# EAGLE schematic working (EAGLE 7.7.0)

## Sheet 1 of 10
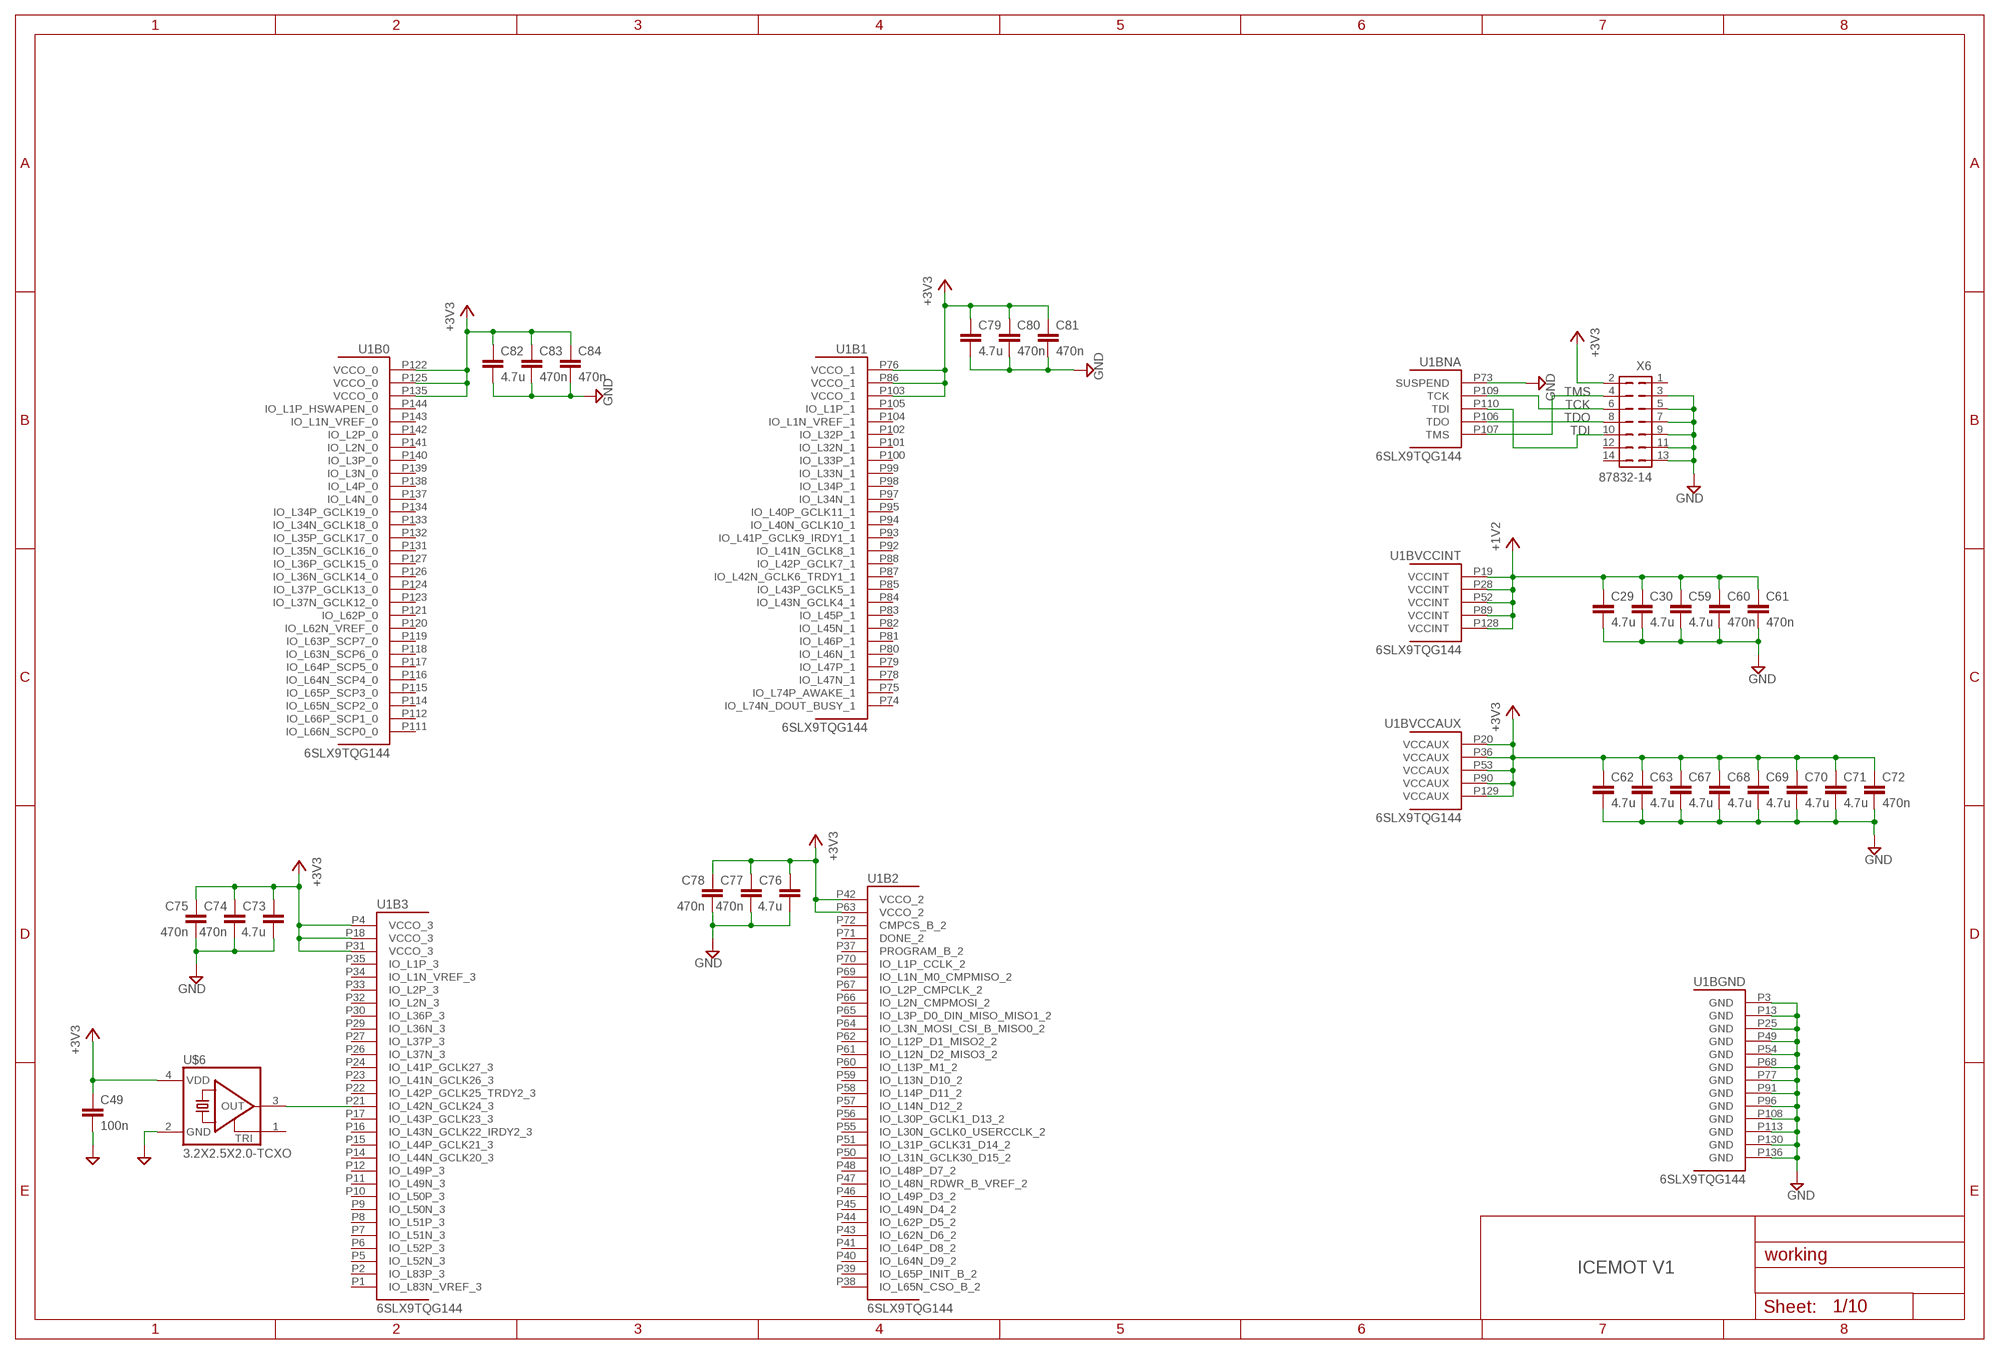
[diagram p0: schematic, sheet 1]

### Parts
C29  4.7u  C-EUC0603  [C0603]
C30  4.7u  C-EUC0603  [C0603]
C49  100n  CAP_0603  [R0603]
C59  4.7u  C-EUC0603  [C0603]
C60  470n  C-EUC0603  [C0603]
C61  470n  C-EUC0603  [C0603]
C62  4.7u  C-EUC0603  [C0603]
C63  4.7u  C-EUC0603  [C0603]
C67  4.7u  C-EUC0603  [C0603]
C68  4.7u  C-EUC0603  [C0603]
C69  4.7u  C-EUC0603  [C0603]
C70  4.7u  C-EUC0603  [C0603]
C71  4.7u  C-EUC0603  [C0603]
C72  470n  C-EUC0603  [C0603]
C73  4.7u  C-EUC0603  [C0603]
C74  470n  C-EUC0603  [C0603]
C75  470n  C-EUC0603  [C0603]
C76  4.7u  C-EUC0603  [C0603]
C77  470n  C-EUC0603  [C0603]
C78  470n  C-EUC0603  [C0603]
C79  4.7u  C-EUC0603  [C0603]
C80  470n  C-EUC0603  [C0603]
C81  470n  C-EUC0603  [C0603]
C82  4.7u  C-EUC0603  [C0603]
C83  470n  C-EUC0603  [C0603]
C84  470n  C-EUC0603  [C0603]
U1  6SLX9TQG144  [TQ144]
U$6  3.2X2.5X2.0-TCXO  [3.2X2.5X2.0-TCXO]
X6  87832-14  [87832-14]

### Nets
+1V2 [power]: C29.1 C30.1 C59.1 C60.1 C61.1
+3V3: C49.1 C62.1 C63.1 C67.1 C68.1 C69.1 C70.1 C71.1 C72.1 C73.1 C74.1 C75.1 C76.1 C77.1 C78.1 C79.1 C80.1 C81.1 C82.1 C83.1 C84.1 U1.P20(BVCCAUX:VCCAUX) U1.P36(BVCCAUX:VCCAUX) U1.P53(BVCCAUX:VCCAUX) U1.P90(BVCCAUX:VCCAUX) U1.P129(BVCCAUX:VCCAUX) U$6.4(VDD) X6.2 ; also sheet 2,3,4,5,6,7,8,9,10
GND: C29.2 C30.2 C49.2 C59.2 C60.2 C61.2 C62.2 C63.2 C67.2 C68.2 C69.2 C70.2 C71.2 C72.2 C73.2 C74.2 C75.2 C76.2 C77.2 C78.2 C79.2 C80.2 C81.2 C82.2 C83.2 C84.2 U1.P3(BGND:GND) U1.P13(BGND:GND) U1.P25(BGND:GND) U1.P49(BGND:GND) U1.P54(BGND:GND) U1.P68(BGND:GND) U1.P73(BNA:SUSPEND) U1.P77(BGND:GND) U1.P91(BGND:GND) U1.P96(BGND:GND) U1.P108(BGND:GND) U1.P113(BGND:GND) U1.P130(BGND:GND) U1.P136(BGND:GND) U$6.2(GND) X6.3 X6.5 X6.7 X6.9 X6.11 X6.13 ; also sheet 2,3,4,5,6,7,8,9,10
N$58: U1.P21(B3:IO_L42N_GCLK24_3) U$6.3(OUT)
TCK: U1.P109(BNA:TCK) X6.6
TDI: U1.P110(BNA:TDI) X6.10
TDO: U1.P106(BNA:TDO) X6.8
TMS: U1.P107(BNA:TMS) X6.4
Unconnected: U1.P1(B3:IO_L83N_VREF_3) U1.P2(B3:IO_L83P_3) U1.P4(B3:VCCO_3) U1.P5(B3:IO_L52N_3) U1.P6(B3:IO_L52P_3) U1.P7(B3:IO_L51N_3) U1.P8(B3:IO_L51P_3) U1.P9(B3:IO_L50N_3) U1.P10(B3:IO_L50P_3) U1.P11(B3:IO_L49N_3) U1.P12(B3:IO_L49P_3) U1.P14(B3:IO_L44N_GCLK20_3) U1.P15(B3:IO_L44P_GCLK21_3) U1.P16(B3:IO_L43N_GCLK22_IRDY2_3) U1.P17(B3:IO_L43P_GCLK23_3) U1.P18(B3:VCCO_3) U1.P19(BVCCINT:VCCINT) U1.P22(B3:IO_L42P_GCLK25_TRDY2_3) U1.P23(B3:IO_L41N_GCLK26_3) U1.P24(B3:IO_L41P_GCLK27_3) U1.P26(B3:IO_L37N_3) U1.P27(B3:IO_L37P_3) U1.P28(BVCCINT:VCCINT) U1.P29(B3:IO_L36N_3) U1.P30(B3:IO_L36P_3) U1.P31(B3:VCCO_3) U1.P32(B3:IO_L2N_3) U1.P33(B3:IO_L2P_3) U1.P34(B3:IO_L1N_VREF_3) U1.P35(B3:IO_L1P_3) U1.P37(B2:PROGRAM_B_2) U1.P38(B2:IO_L65N_CSO_B_2) U1.P39(B2:IO_L65P_INIT_B_2) U1.P40(B2:IO_L64N_D9_2) U1.P41(B2:IO_L64P_D8_2) U1.P42(B2:VCCO_2) U1.P43(B2:IO_L62N_D6_2) U1.P44(B2:IO_L62P_D5_2) U1.P45(B2:IO_L49N_D4_2) U1.P46(B2:IO_L49P_D3_2) U1.P47(B2:IO_L48N_RDWR_B_VREF_2) U1.P48(B2:IO_L48P_D7_2) U1.P50(B2:IO_L31N_GCLK30_D15_2) U1.P51(B2:IO_L31P_GCLK31_D14_2) U1.P52(BVCCINT:VCCINT) U1.P55(B2:IO_L30N_GCLK0_USERCCLK_2) U1.P56(B2:IO_L30P_GCLK1_D13_2) U1.P57(B2:IO_L14N_D12_2) U1.P58(B2:IO_L14P_D11_2) U1.P59(B2:IO_L13N_D10_2) U1.P60(B2:IO_L13P_M1_2) U1.P61(B2:IO_L12N_D2_MISO3_2) U1.P62(B2:IO_L12P_D1_MISO2_2) U1.P63(B2:VCCO_2) U1.P64(B2:IO_L3N_MOSI_CSI_B_MISO0_2) U1.P65(B2:IO_L3P_D0_DIN_MISO_MISO1_2) U1.P66(B2:IO_L2N_CMPMOSI_2) U1.P67(B2:IO_L2P_CMPCLK_2) U1.P69(B2:IO_L1N_M0_CMPMISO_2) U1.P70(B2:IO_L1P_CCLK_2) U1.P71(B2:DONE_2) U1.P72(B2:CMPCS_B_2) U1.P74(B1:IO_L74N_DOUT_BUSY_1) U1.P75(B1:IO_L74P_AWAKE_1) U1.P76(B1:VCCO_1) U1.P78(B1:IO_L47N_1) U1.P79(B1:IO_L47P_1) U1.P80(B1:IO_L46N_1) U1.P81(B1:IO_L46P_1) U1.P82(B1:IO_L45N_1) U1.P83(B1:IO_L45P_1) U1.P84(B1:IO_L43N_GCLK4_1) U1.P85(B1:IO_L43P_GCLK5_1) U1.P86(B1:VCCO_1) U1.P87(B1:IO_L42N_GCLK6_TRDY1_1) U1.P88(B1:IO_L42P_GCLK7_1) U1.P89(BVCCINT:VCCINT) U1.P92(B1:IO_L41N_GCLK8_1) U1.P93(B1:IO_L41P_GCLK9_IRDY1_1) U1.P94(B1:IO_L40N_GCLK10_1) U1.P95(B1:IO_L40P_GCLK11_1) U1.P97(B1:IO_L34N_1) U1.P98(B1:IO_L34P_1) U1.P99(B1:IO_L33N_1) U1.P100(B1:IO_L33P_1) U1.P101(B1:IO_L32N_1) U1.P102(B1:IO_L32P_1) U1.P103(B1:VCCO_1) U1.P104(B1:IO_L1N_VREF_1) U1.P105(B1:IO_L1P_1) U1.P111(B0:IO_L66N_SCP0_0) U1.P112(B0:IO_L66P_SCP1_0) U1.P114(B0:IO_L65N_SCP2_0) U1.P115(B0:IO_L65P_SCP3_0) U1.P116(B0:IO_L64N_SCP4_0) U1.P117(B0:IO_L64P_SCP5_0) U1.P118(B0:IO_L63N_SCP6_0) U1.P119(B0:IO_L63P_SCP7_0) U1.P120(B0:IO_L62N_VREF_0) U1.P121(B0:IO_L62P_0) U1.P122(B0:VCCO_0) U1.P123(B0:IO_L37N_GCLK12_0) U1.P124(B0:IO_L37P_GCLK13_0) U1.P125(B0:VCCO_0) U1.P126(B0:IO_L36N_GCLK14_0) U1.P127(B0:IO_L36P_GCLK15_0) U1.P128(BVCCINT:VCCINT) U1.P131(B0:IO_L35N_GCLK16_0) U1.P132(B0:IO_L35P_GCLK17_0) U1.P133(B0:IO_L34N_GCLK18_0) U1.P134(B0:IO_L34P_GCLK19_0) U1.P135(B0:VCCO_0) U1.P137(B0:IO_L4N_0) U1.P138(B0:IO_L4P_0) U1.P139(B0:IO_L3N_0) U1.P140(B0:IO_L3P_0) U1.P141(B0:IO_L2N_0) U1.P142(B0:IO_L2P_0) U1.P143(B0:IO_L1N_VREF_0) U1.P144(B0:IO_L1P_HSWAPEN_0) U$6.1(TRI) X6.1 X6.12 X6.14

### Notes on the sheet
- ICEMOT V1

## Sheet 2 of 10
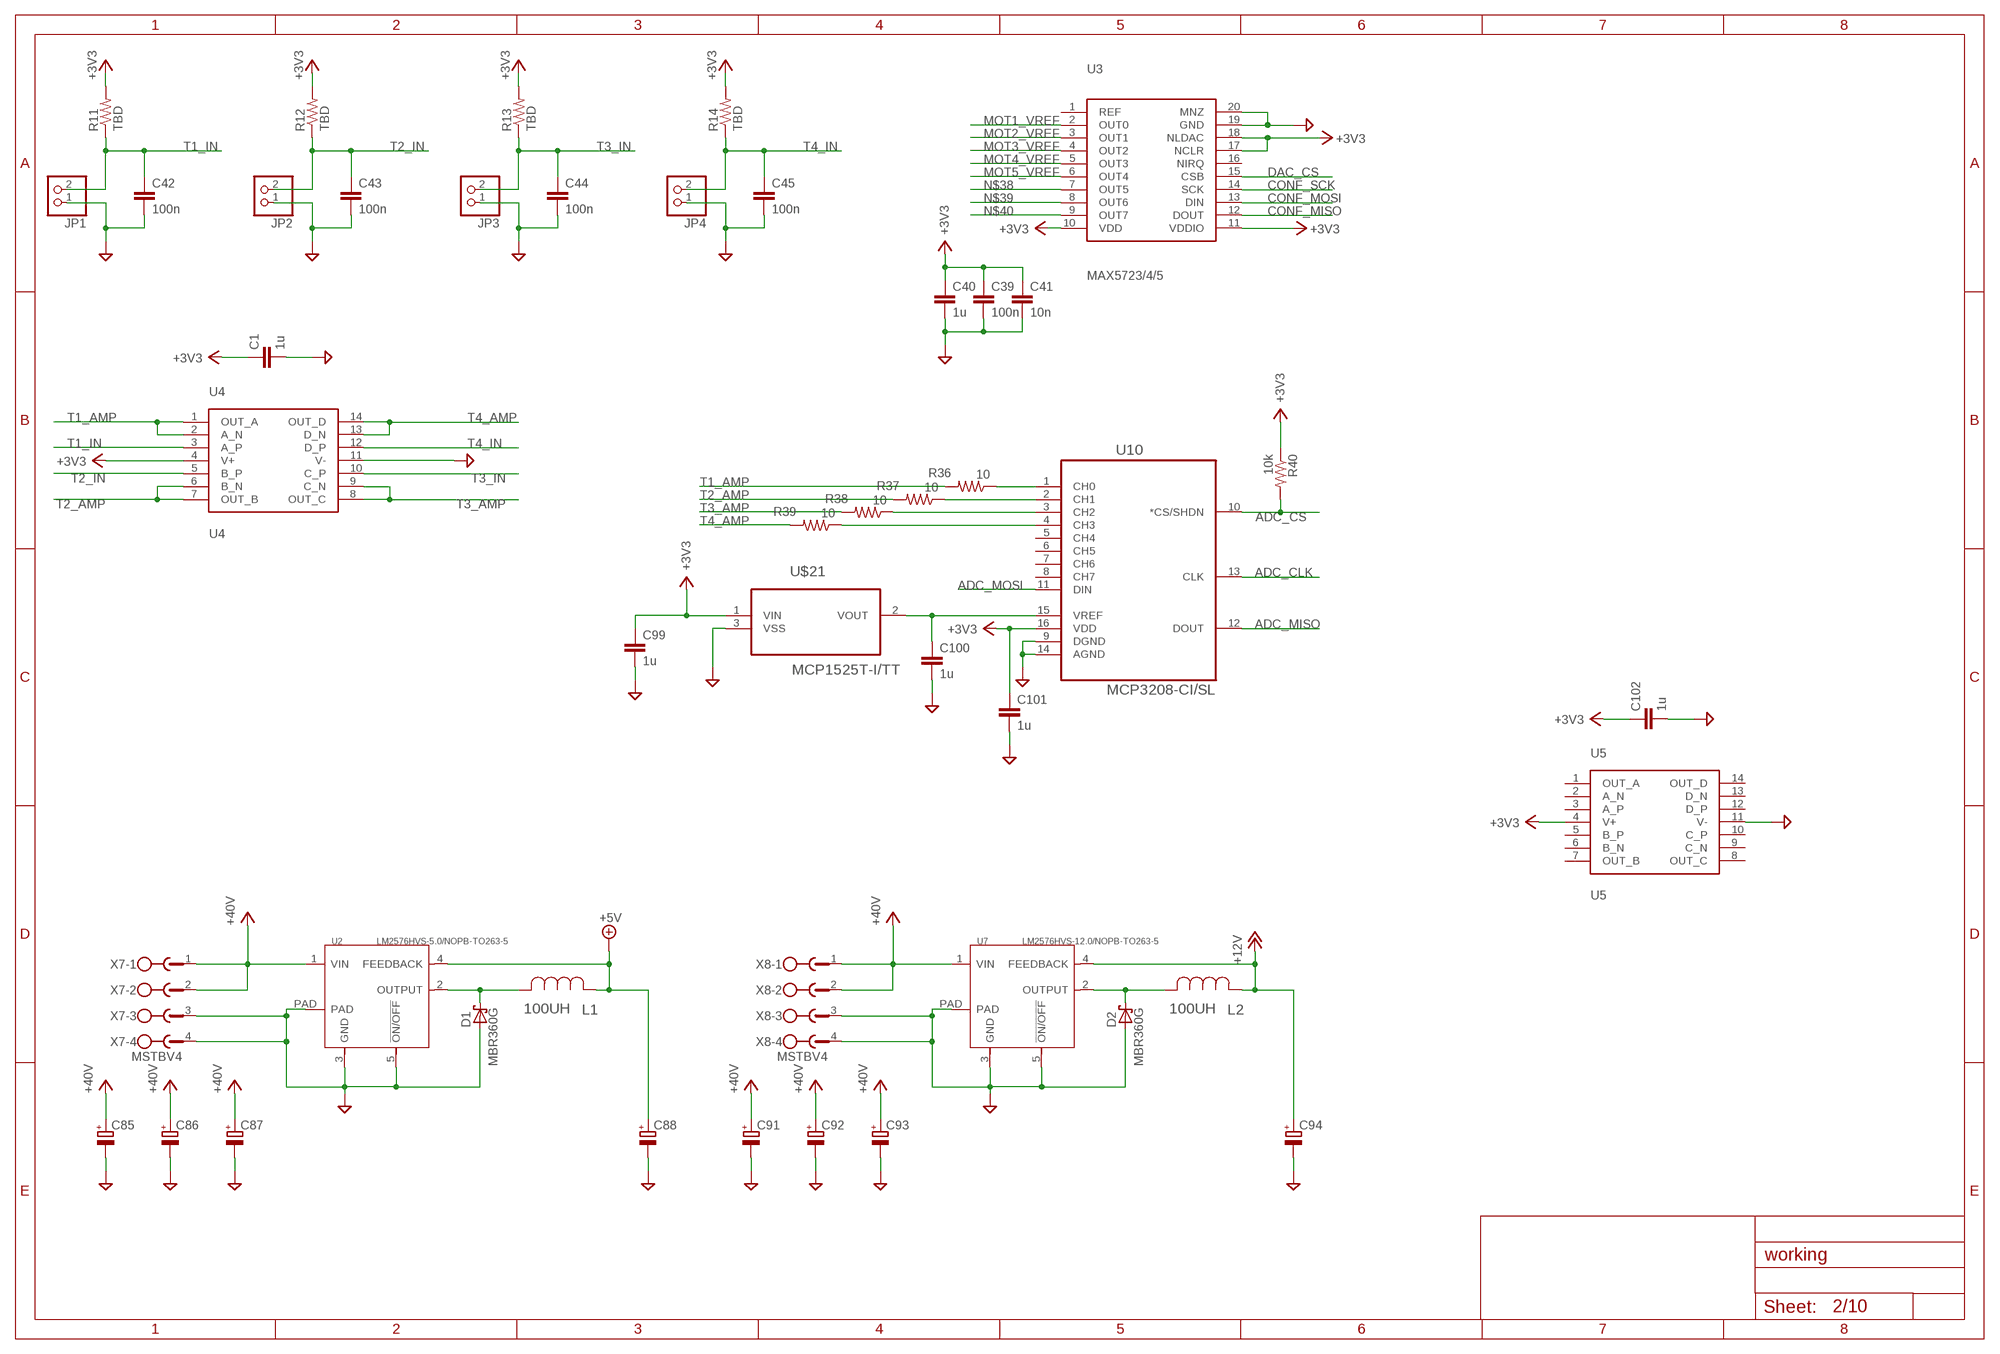
[diagram p1: schematic, sheet 2]

### Parts
C1  1u  CAP_0603  [R0603]
C39  100n  CAP_0603  [R0603]
C40  1u  CAP_0603  [R0603]
C41  10n  CAP_0603  [R0603]
C42  100n  CAP_0603  [R0603]
C43  100n  CAP_0603  [R0603]
C44  100n  CAP_0603  [R0603]
C45  100n  CAP_0603  [R0603]
C85  CPOL-EUE5-10.5  [E5-10,5]
C86  CPOL-EUE5-10.5  [E5-10,5]
C87  CPOL-EUE5-10.5  [E5-10,5]
C88  CPOL-EUE5-10.5  [E5-10,5]
C91  CPOL-EUE5-10.5  [E5-10,5]
C92  CPOL-EUE5-10.5  [E5-10,5]
C93  CPOL-EUE5-10.5  [E5-10,5]
C94  CPOL-EUE5-10.5  [E5-10,5]
C99  1u  CAP_0603  [R0603]
C100  1u  CAP_0603  [R0603]
C101  1u  CAP_0603  [R0603]
C102  1u  CAP_0603  [R0603]
D1  MBR360G  SCHOTTKY-DIODEDO201T15  [DO201T15]
D2  MBR360G  SCHOTTKY-DIODEDO201T15  [DO201T15]
JP1  PINHD-1X2  [1X02]
JP2  PINHD-1X2  [1X02]
JP3  PINHD-1X2  [1X02]
JP4  PINHD-1X2  [1X02]
L1  100UH  ELC18B101L-18B  [IND_ELC18B]
L2  100UH  ELC18B101L-18B  [IND_ELC18B]
R11  TBD  RES_0603  [R0603]
R12  TBD  RES_0603  [R0603]
R13  TBD  RES_0603  [R0603]
R14  TBD  RES_0603  [R0603]
R36  10  RES_0603  [R0603]
R37  10  RES_0603  [R0603]
R38  10  RES_0603  [R0603]
R39  10  RES_0603  [R0603]
R40  10k  RES_0603  [R0603]
U2  LM2576HVS-5.0/NOPB-TO263-5  PMIC-LM2576HVS-5.0/NOPB(TO263-5)  [TO-263-5]
U3  MAX5723/4/5  [TSSOP20-0.65-6.5X4.4MM]
U4  TLV4379  [TSSOP14-0.65-5X4.4MM]
U5  TLV4379  [TSSOP14-0.65-5X4.4MM]
U7  LM2576HVS-12.0/NOPB-TO263-5  PMIC-LM2575HVS-12.0/NOPB(TO263-5)  [TO-263-5]
U10  MCP3208-CI/SL  [SOIC127P600X175-16N]
U$21  MCP1525T-I/TT  [SOT96P237X112-3N]
X7  MSTBV4  [MSTBV4]
X8  MSTBV4  [MSTBV4]

### Nets
+3V3: C1.1 C39.1 C40.1 C41.1 C99.1 C101.1 C102.1 R11.2 R12.2 R13.2 R14.2 R40.1 U3.10(VDD) U3.11(VDDIO) U3.17(NCLR) U3.18(NLDAC) U4.4(V+) U10.16(VDD) U$21.1(VIN) ; also sheet 1,3,4,5,6,7,8,9,10
+5V: C88.+ L1.1 U2.4(FEEDBACK)
+12V: C94.+ L2.1 U7.4(FEEDBACK) ; also sheet 8,9,10
+40V: C85.+ C86.+ C87.+ C91.+ C92.+ C93.+ U2.1(VIN) U7.1(VIN) X7.1 X7.2 X8.1 X8.2 ; also sheet 3,4,5,6,7
ADC_CLK: U10.13(CLK)
ADC_CS: R40.2 U10.10(*CS/SHDN)
ADC_MISO: U10.12(DOUT)
ADC_MOSI: U10.11(DIN)
CONF_MISO: U3.12(DOUT)
CONF_MOSI: U3.13(DIN)
CONF_SCK: U3.14(SCK)
DAC_CS: U3.15(CSB)
GND: C1.2 C39.2 C40.2 C41.2 C42.2 C43.2 C44.2 C45.2 C85.- C86.- C87.- C88.- C91.- C92.- C93.- C94.- C99.2 C100.2 C101.2 C102.2 D1.A D2.A JP1.1 JP2.1 JP3.1 JP4.1 U2.3(GND) U2.5(!ON/OFF) U2.PAD U3.19(GND) U3.20(MNZ) U4.11(V-) U7.3(GND) U7.5(!ON/OFF) U7.PAD U10.9(DGND) U10.14(AGND) U$21.3(VSS) X7.3 X7.4 X8.3 X8.4 ; also sheet 1,3,4,5,6,7,8,9,10
MOT1_VREF: U3.2(OUT0) ; also sheet 3
MOT2_VREF: U3.3(OUT1) ; also sheet 4
MOT3_VREF: U3.4(OUT2) ; also sheet 5
MOT4_VREF: U3.5(OUT3) ; also sheet 6
MOT5_VREF: U3.6(OUT4) ; also sheet 7
N$37: D1.C L1.2 U2.2(OUTPUT)
N$38: U3.7(OUT5)
N$39: U3.8(OUT6)
N$40: U3.9(OUT7)
N$61: D2.C L2.2 U7.2(OUTPUT)
N$72: C100.1 U10.15(VREF) U$21.2(VOUT)
N$74: R36.1 U10.1(CH0)
N$75: R37.1 U10.2(CH1)
N$76: R38.1 U10.3(CH2)
N$77: R39.1 U10.4(CH3)
T1_AMP: R36.2 U4.1(OUT_A) U4.2(A_N)
T1_IN: C42.1 JP1.2 R11.1 U4.3(A_P)
T2_AMP: R37.2 U4.6(B_N) U4.7(OUT_B)
T2_IN: C43.1 JP2.2 R12.1 U4.5(B_P)
T3_AMP: R38.2 U4.8(OUT_C) U4.9(C_N)
T3_IN: C44.1 JP3.2 R13.1 U4.10(C_P)
T4_AMP: R39.2 U4.13(D_N) U4.14(OUT_D)
T4_IN: C45.1 JP4.2 R14.1 U4.12(D_P)
Unconnected: U3.1(REF) U3.16(NIRQ) U5.1(OUT_A) U5.2(A_N) U5.3(A_P) U5.5(B_P) U5.6(B_N) U5.7(OUT_B) U5.8(OUT_C) U5.9(C_N) U5.10(C_P) U5.12(D_P) U5.13(D_N) U5.14(OUT_D) U10.5(CH4) U10.6(CH5) U10.7(CH6) U10.8(CH7)

## Sheet 3 of 10
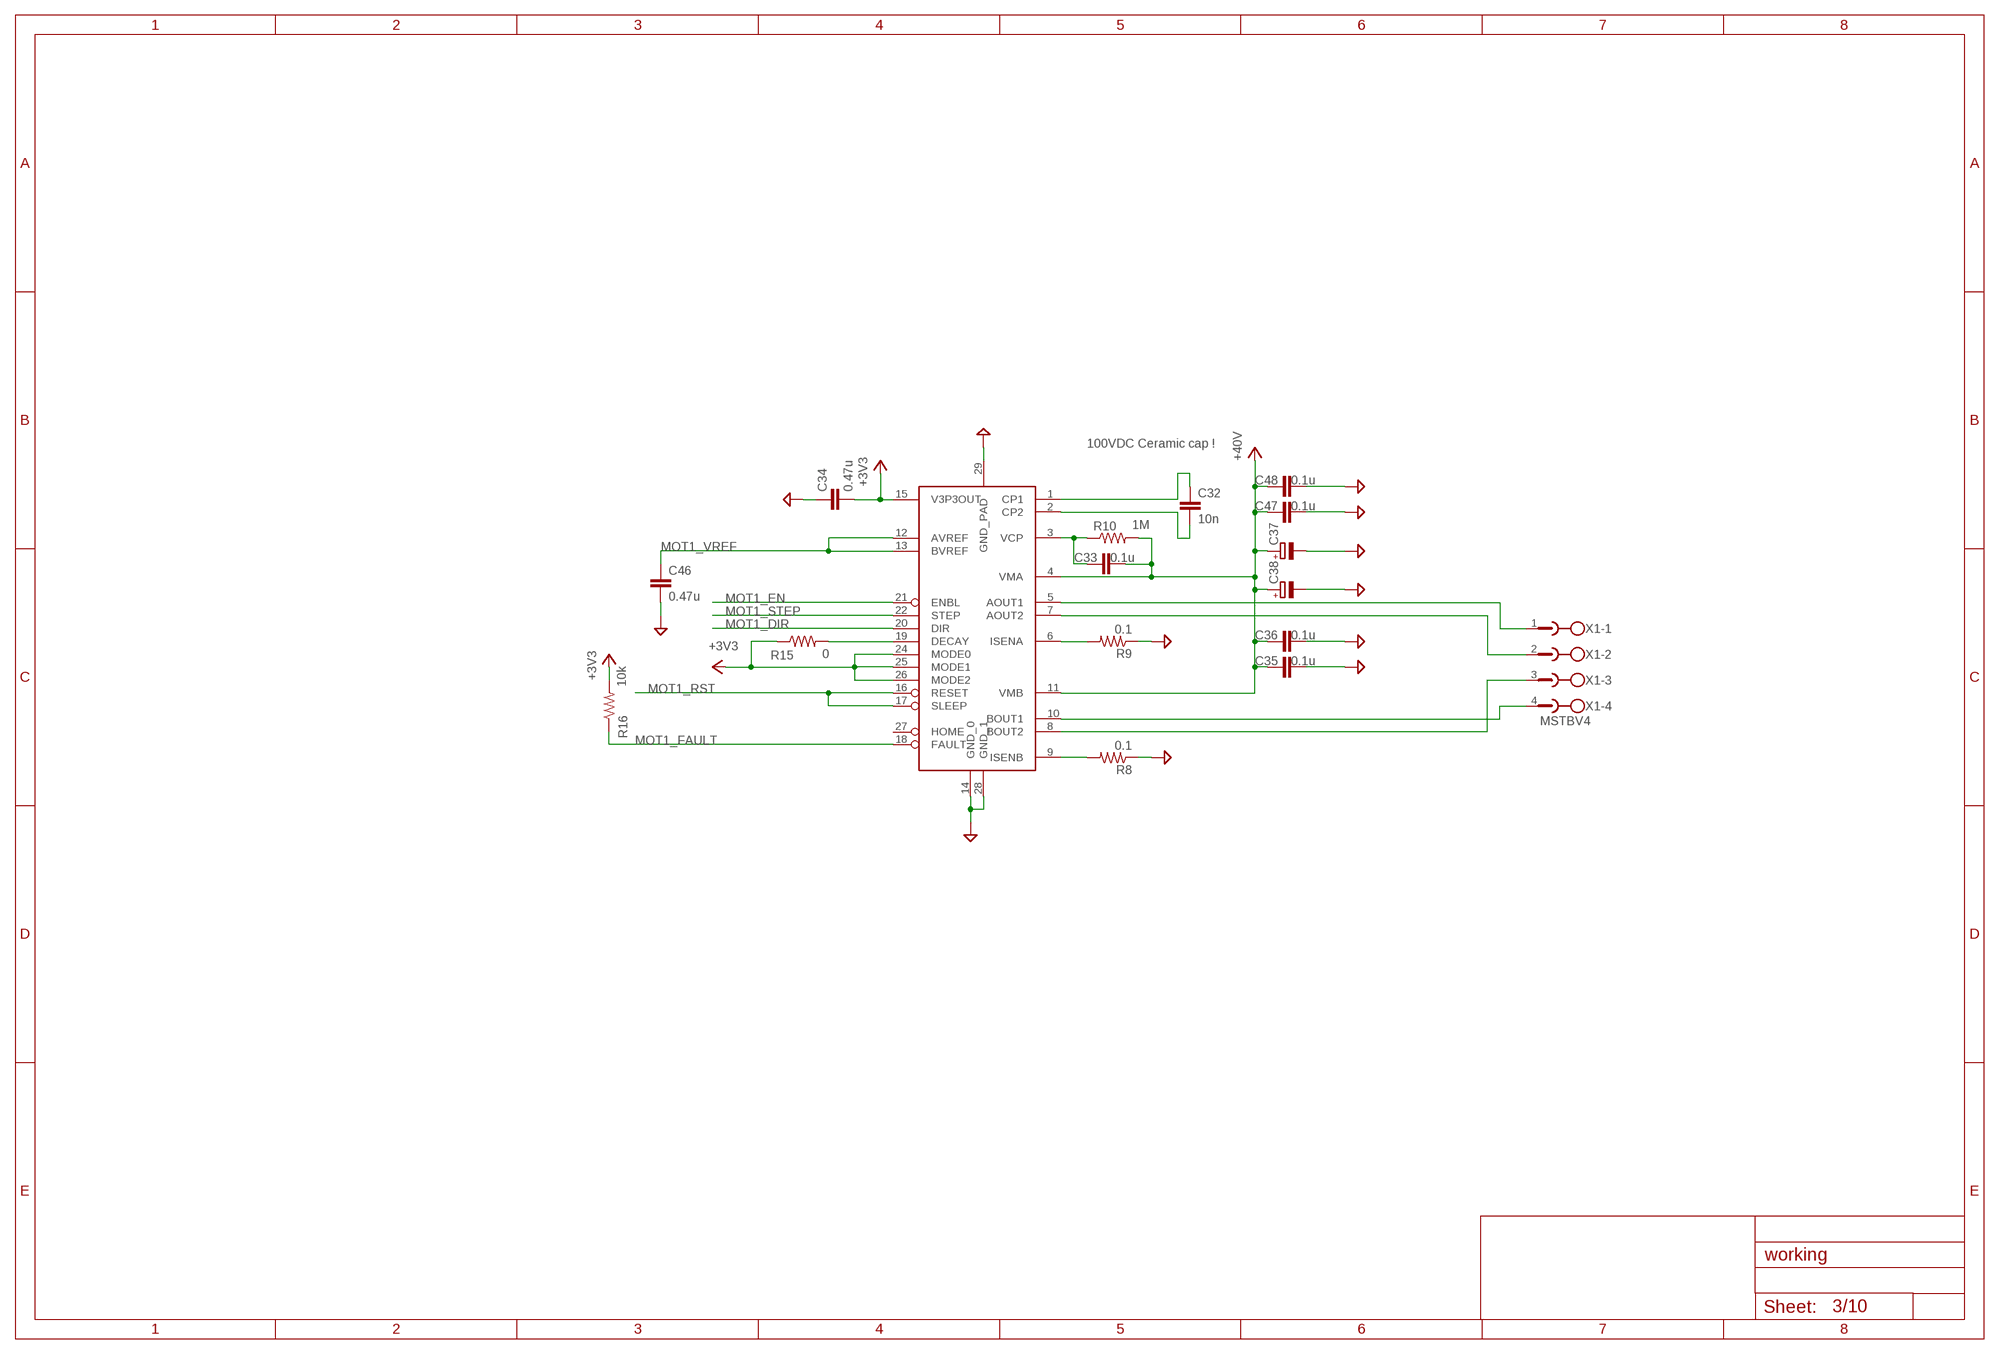
[diagram p2: schematic, sheet 3]

### Parts
C32  10n  CAP_0603  [R0603]
C33  0.1u  CAP_0603  [R0603]
C34  0.47u  CAP_0603  [R0603]
C35  0.1u  CAP_0603  [R0603]
C36  0.1u  CAP_0603  [R0603]
C37  CPOL-EUE5-5  [E5-5]
C38  CPOL-EUE5-5  [E5-5]
C46  0.47u  CAP_0603  [R0603]
C47  0.1u  CAP_0603  [R0603]
C48  0.1u  CAP_0603  [R0603]
R8  0.1  RES_1206  [R1206]
R9  0.1  RES_1206  [R1206]
R10  1M  RES_0603  [R0603]
R15  0  RES_0603  [R0603]
R16  10k  RES_0603  [R0603]
U$4  DRV8825PWP  [TSSOP-28]
X1  MSTBV4  [MSTBV4]

### Nets
+3V3: C34.2 R15.1 R16.2 U$4.15(V3P3OUT) U$4.24(MODE0) U$4.25(MODE1) U$4.26(MODE2) ; also sheet 1,2,4,5,6,7,8,9,10
+40V: C33.2 C35.1 C36.1 C37.+ C38.+ C47.1 C48.1 R10.2 U$4.4(VMA) U$4.11(VMB) ; also sheet 2,4,5,6,7
GND: C34.1 C35.2 C36.2 C37.- C38.- C46.2 C47.2 C48.2 R8.1 R9.1 U$4.14(GND_0) U$4.28(GND_1) U$4.29(GND_PAD) ; also sheet 1,2,4,5,6,7,8,9,10
MOT1_DIR: U$4.20(DIR)
MOT1_EN: U$4.21(ENBL)
MOT1_FAULT: R16.1 U$4.18(FAULT)
MOT1_RST: U$4.16(RESET) U$4.17(SLEEP)
MOT1_STEP: U$4.22(STEP)
MOT1_VREF: C46.1 U$4.12(AVREF) U$4.13(BVREF) ; also sheet 2
N$16: R9.2 U$4.6(ISENA)
N$17: R8.2 U$4.9(ISENB)
N$18: C32.1 U$4.1(CP1)
N$19: C32.2 U$4.2(CP2)
N$20: C33.1 R10.1 U$4.3(VCP)
N$24: R15.2 U$4.19(DECAY)
N$29: U$4.5(AOUT1) X1.1
N$30: U$4.7(AOUT2) X1.2
N$31: U$4.8(BOUT2) X1.3
N$32: U$4.10(BOUT1) X1.4
Unconnected: U$4.27(HOME)

### Notes on the sheet
- 100VDC Ceramic cap !

## Sheet 4 of 10
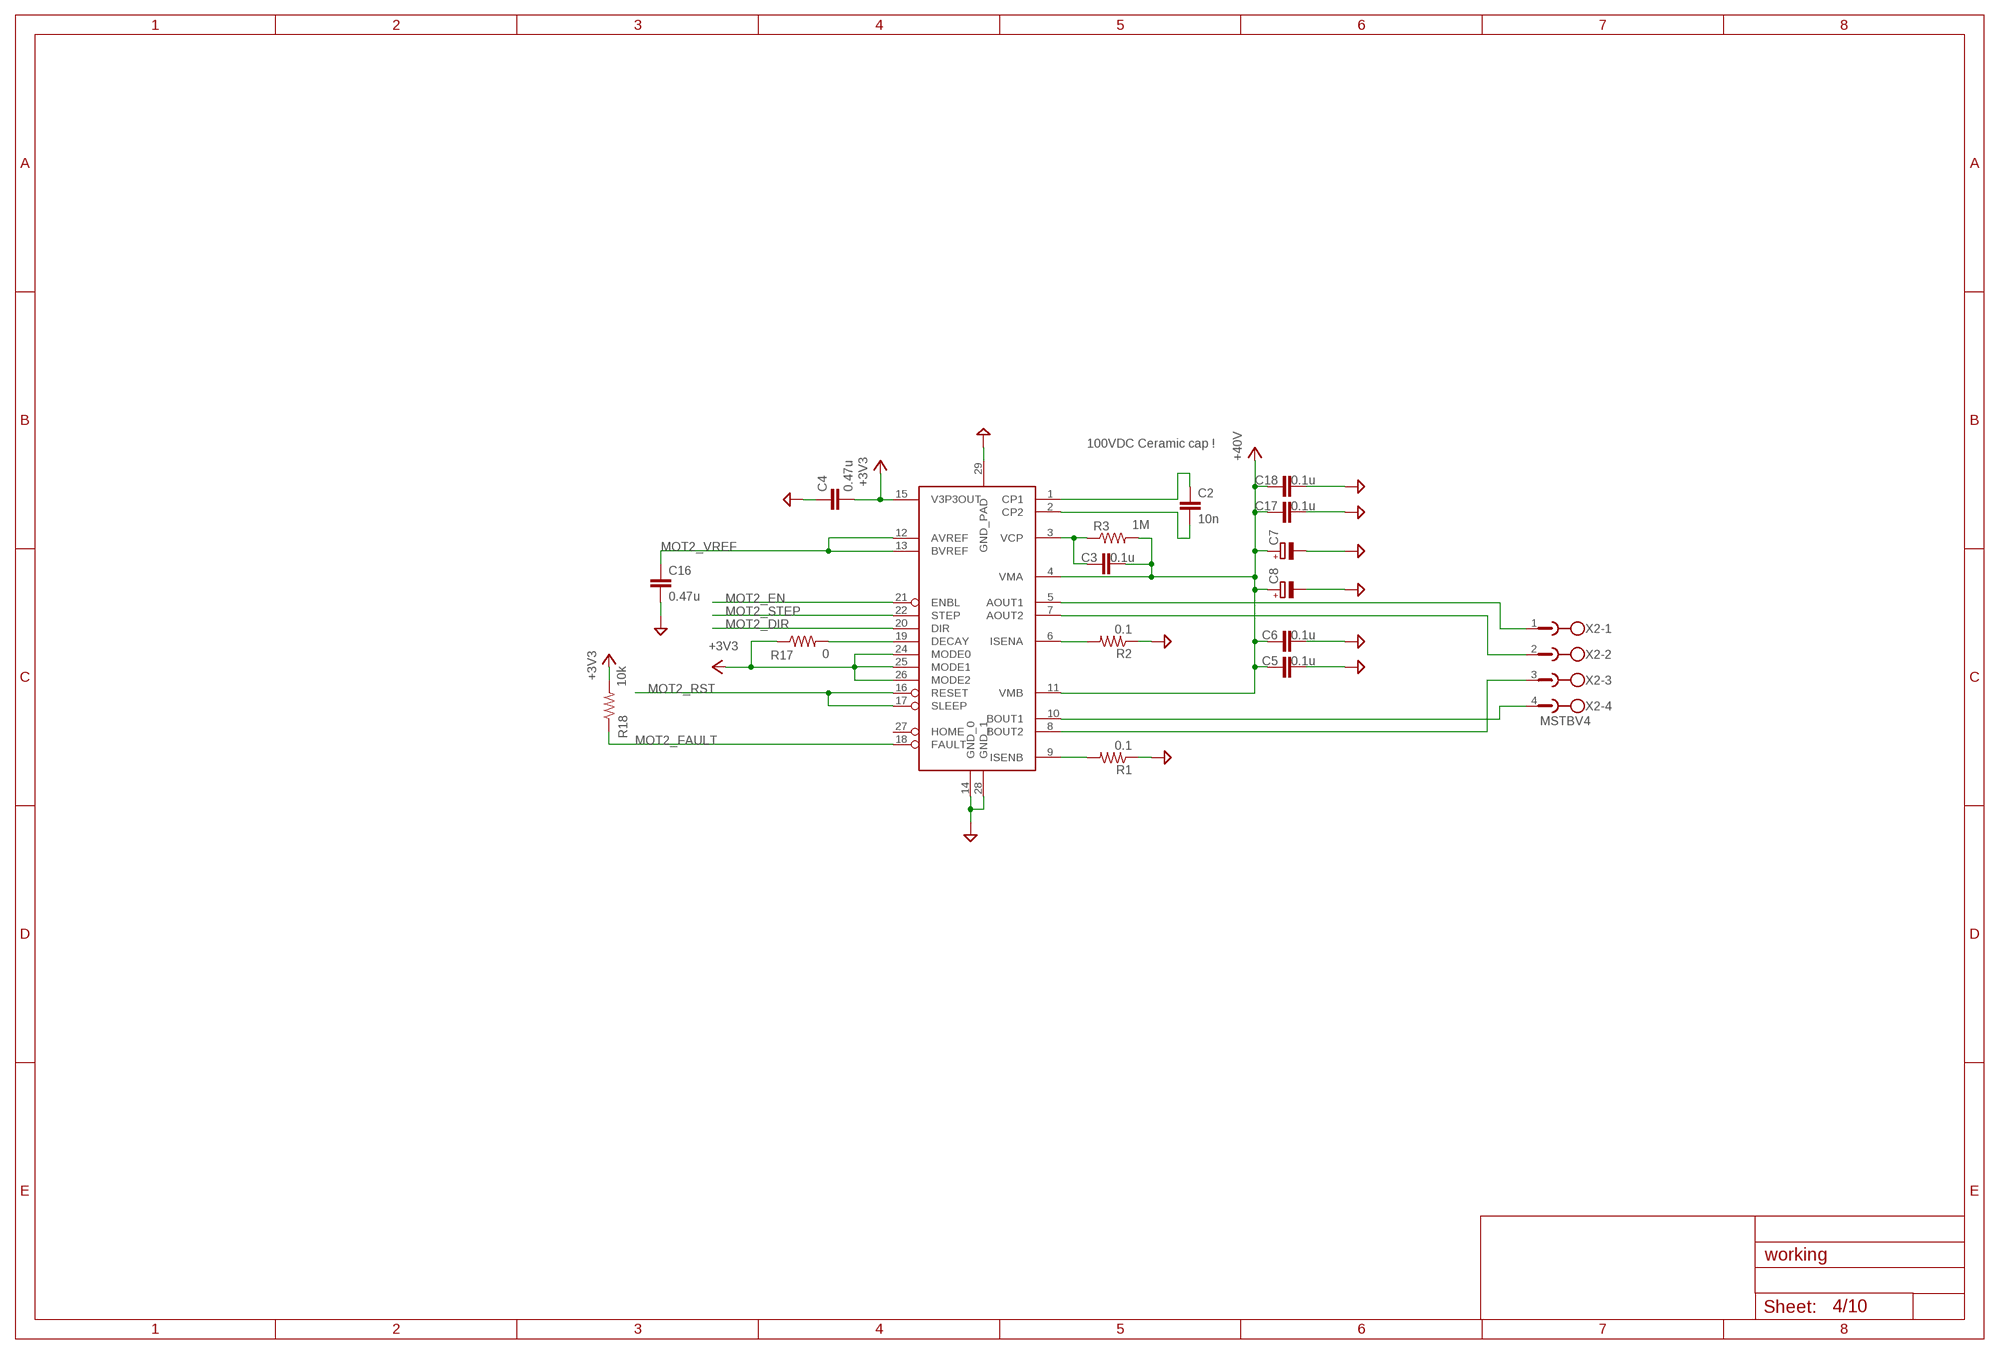
[diagram p3: schematic, sheet 4]

### Parts
C2  10n  CAP_0603  [R0603]
C3  0.1u  CAP_0603  [R0603]
C4  0.47u  CAP_0603  [R0603]
C5  0.1u  CAP_0603  [R0603]
C6  0.1u  CAP_0603  [R0603]
C7  CPOL-EUE5-5  [E5-5]
C8  CPOL-EUE5-5  [E5-5]
C16  0.47u  CAP_0603  [R0603]
C17  0.1u  CAP_0603  [R0603]
C18  0.1u  CAP_0603  [R0603]
R1  0.1  RES_1206  [R1206]
R2  0.1  RES_1206  [R1206]
R3  1M  RES_0603  [R0603]
R17  0  RES_0603  [R0603]
R18  10k  RES_0603  [R0603]
U$1  DRV8825PWP  [TSSOP-28]
X2  MSTBV4  [MSTBV4]

### Nets
+3V3: C4.2 R17.1 R18.2 U$1.15(V3P3OUT) U$1.24(MODE0) U$1.25(MODE1) U$1.26(MODE2) ; also sheet 1,2,3,5,6,7,8,9,10
+40V: C3.2 C5.1 C6.1 C7.+ C8.+ C17.1 C18.1 R3.2 U$1.4(VMA) U$1.11(VMB) ; also sheet 2,3,5,6,7
GND: C4.1 C5.2 C6.2 C7.- C8.- C16.2 C17.2 C18.2 R1.1 R2.1 U$1.14(GND_0) U$1.28(GND_1) U$1.29(GND_PAD) ; also sheet 1,2,3,5,6,7,8,9,10
MOT2_DIR: U$1.20(DIR)
MOT2_EN: U$1.21(ENBL)
MOT2_FAULT: R18.1 U$1.18(FAULT)
MOT2_RST: U$1.16(RESET) U$1.17(SLEEP)
MOT2_STEP: U$1.22(STEP)
MOT2_VREF: C16.1 U$1.12(AVREF) U$1.13(BVREF) ; also sheet 2
N$1: R2.2 U$1.6(ISENA)
N$2: R1.2 U$1.9(ISENB)
N$3: C2.1 U$1.1(CP1)
N$4: C2.2 U$1.2(CP2)
N$5: C3.1 R3.1 U$1.3(VCP)
N$6: U$1.5(AOUT1) X2.1
N$7: U$1.7(AOUT2) X2.2
N$8: U$1.8(BOUT2) X2.3
N$9: U$1.10(BOUT1) X2.4
N$10: R17.2 U$1.19(DECAY)
Unconnected: U$1.27(HOME)

### Notes on the sheet
- 100VDC Ceramic cap !

## Sheet 5 of 10
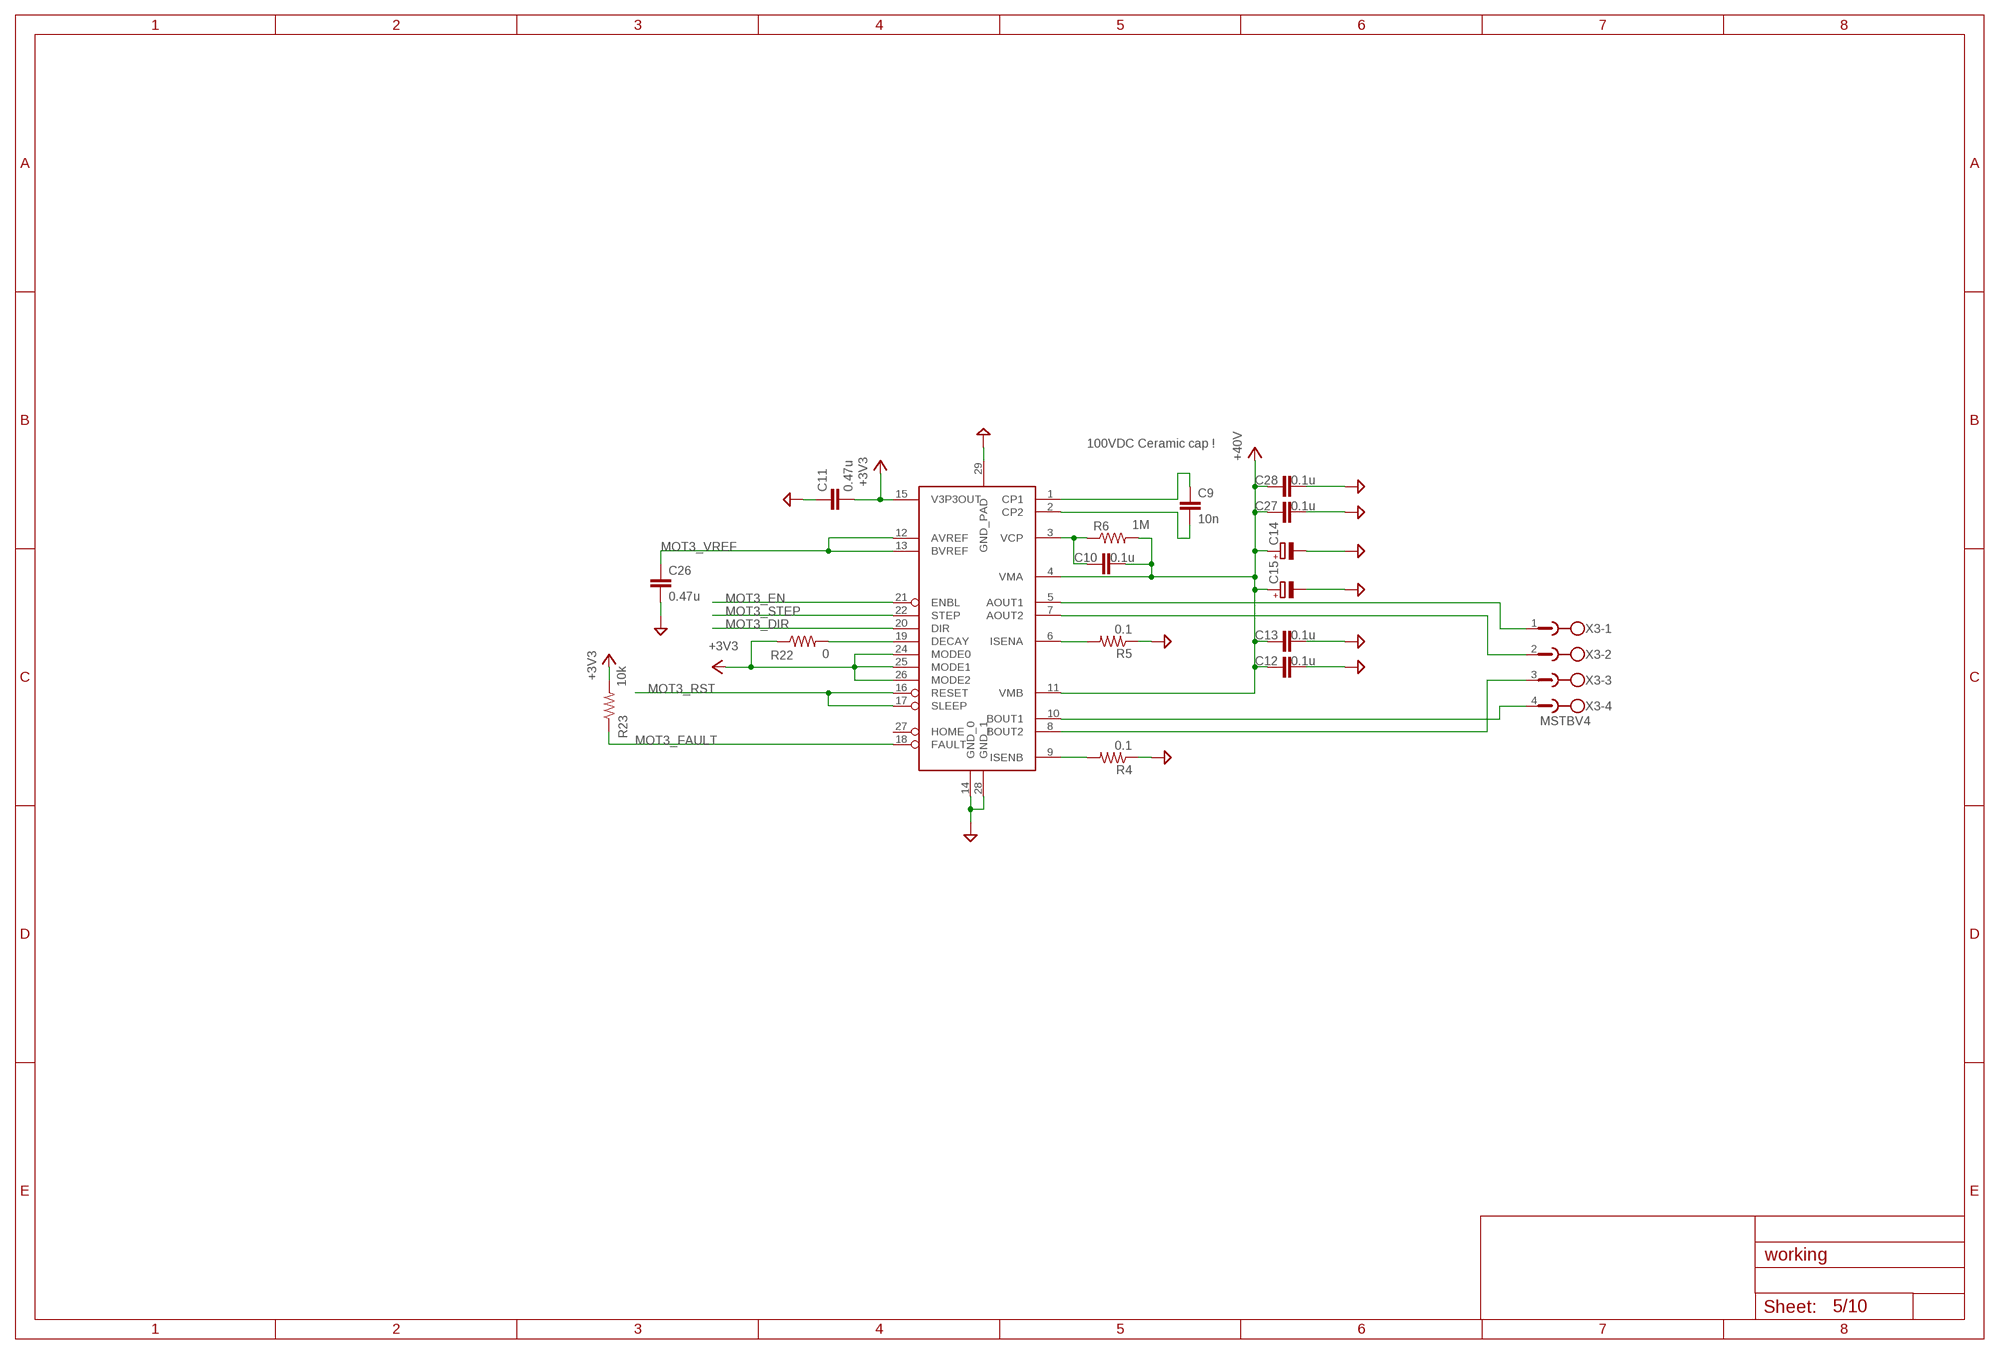
[diagram p4: schematic, sheet 5]

### Parts
C9  10n  CAP_0603  [R0603]
C10  0.1u  CAP_0603  [R0603]
C11  0.47u  CAP_0603  [R0603]
C12  0.1u  CAP_0603  [R0603]
C13  0.1u  CAP_0603  [R0603]
C14  CPOL-EUE5-5  [E5-5]
C15  CPOL-EUE5-5  [E5-5]
C26  0.47u  CAP_0603  [R0603]
C27  0.1u  CAP_0603  [R0603]
C28  0.1u  CAP_0603  [R0603]
R4  0.1  RES_1206  [R1206]
R5  0.1  RES_1206  [R1206]
R6  1M  RES_0603  [R0603]
R22  0  RES_0603  [R0603]
R23  10k  RES_0603  [R0603]
U$3  DRV8825PWP  [TSSOP-28]
X3  MSTBV4  [MSTBV4]

### Nets
+3V3: C11.2 R22.1 R23.2 U$3.15(V3P3OUT) U$3.24(MODE0) U$3.25(MODE1) U$3.26(MODE2) ; also sheet 1,2,3,4,6,7,8,9,10
+40V: C10.2 C12.1 C13.1 C14.+ C15.+ C27.1 C28.1 R6.2 U$3.4(VMA) U$3.11(VMB) ; also sheet 2,3,4,6,7
GND: C11.1 C12.2 C13.2 C14.- C15.- C26.2 C27.2 C28.2 R4.1 R5.1 U$3.14(GND_0) U$3.28(GND_1) U$3.29(GND_PAD) ; also sheet 1,2,3,4,6,7,8,9,10
MOT3_DIR: U$3.20(DIR)
MOT3_EN: U$3.21(ENBL)
MOT3_FAULT: R23.1 U$3.18(FAULT)
MOT3_RST: U$3.16(RESET) U$3.17(SLEEP)
MOT3_STEP: U$3.22(STEP)
MOT3_VREF: C26.1 U$3.12(AVREF) U$3.13(BVREF) ; also sheet 2
N$11: R5.2 U$3.6(ISENA)
N$12: R4.2 U$3.9(ISENB)
N$13: C9.1 U$3.1(CP1)
N$14: C9.2 U$3.2(CP2)
N$15: C10.1 R6.1 U$3.3(VCP)
N$21: U$3.5(AOUT1) X3.1
N$22: U$3.7(AOUT2) X3.2
N$23: U$3.8(BOUT2) X3.3
N$25: U$3.10(BOUT1) X3.4
N$26: R22.2 U$3.19(DECAY)
Unconnected: U$3.27(HOME)

### Notes on the sheet
- 100VDC Ceramic cap !

## Sheet 6 of 10
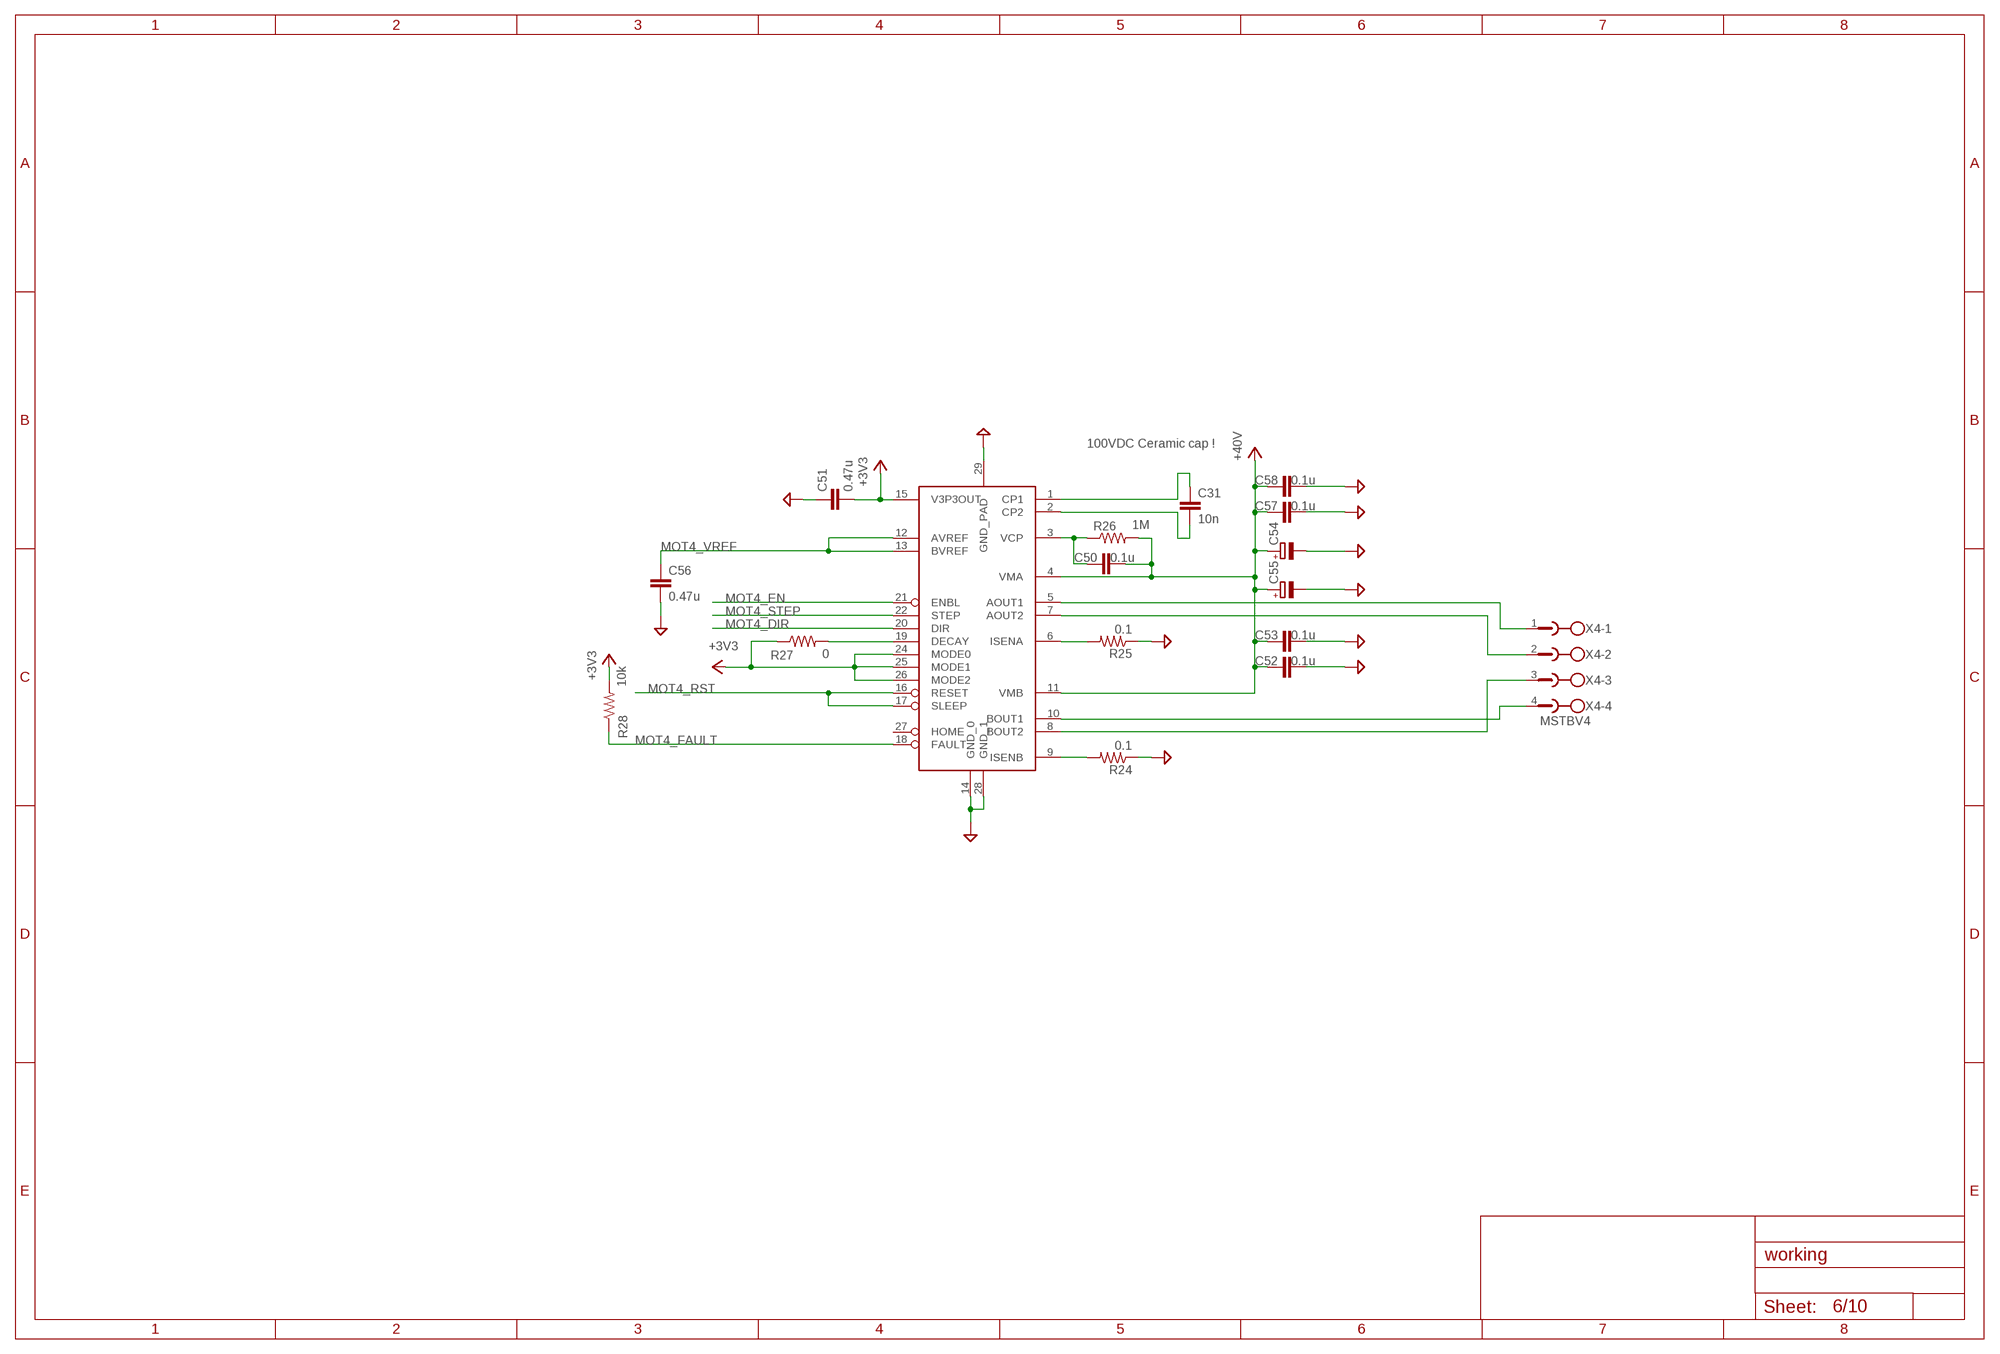
[diagram p5: schematic, sheet 6]

### Parts
C31  10n  CAP_0603  [R0603]
C50  0.1u  CAP_0603  [R0603]
C51  0.47u  CAP_0603  [R0603]
C52  0.1u  CAP_0603  [R0603]
C53  0.1u  CAP_0603  [R0603]
C54  CPOL-EUE5-5  [E5-5]
C55  CPOL-EUE5-5  [E5-5]
C56  0.47u  CAP_0603  [R0603]
C57  0.1u  CAP_0603  [R0603]
C58  0.1u  CAP_0603  [R0603]
R24  0.1  RES_1206  [R1206]
R25  0.1  RES_1206  [R1206]
R26  1M  RES_0603  [R0603]
R27  0  RES_0603  [R0603]
R28  10k  RES_0603  [R0603]
U$9  DRV8825PWP  [TSSOP-28]
X4  MSTBV4  [MSTBV4]

### Nets
+3V3: C51.2 R27.1 R28.2 U$9.15(V3P3OUT) U$9.24(MODE0) U$9.25(MODE1) U$9.26(MODE2) ; also sheet 1,2,3,4,5,7,8,9,10
+40V: C50.2 C52.1 C53.1 C54.+ C55.+ C57.1 C58.1 R26.2 U$9.4(VMA) U$9.11(VMB) ; also sheet 2,3,4,5,7
GND: C51.1 C52.2 C53.2 C54.- C55.- C56.2 C57.2 C58.2 R24.1 R25.1 U$9.14(GND_0) U$9.28(GND_1) U$9.29(GND_PAD) ; also sheet 1,2,3,4,5,7,8,9,10
MOT4_DIR: U$9.20(DIR)
MOT4_EN: U$9.21(ENBL)
MOT4_FAULT: R28.1 U$9.18(FAULT)
MOT4_RST: U$9.16(RESET) U$9.17(SLEEP)
MOT4_STEP: U$9.22(STEP)
MOT4_VREF: C56.1 U$9.12(AVREF) U$9.13(BVREF) ; also sheet 2
N$27: R25.2 U$9.6(ISENA)
N$28: R24.2 U$9.9(ISENB)
N$33: C31.1 U$9.1(CP1)
N$41: C31.2 U$9.2(CP2)
N$42: C50.1 R26.1 U$9.3(VCP)
N$43: U$9.5(AOUT1) X4.1
N$44: U$9.7(AOUT2) X4.2
N$45: U$9.8(BOUT2) X4.3
N$46: U$9.10(BOUT1) X4.4
N$47: R27.2 U$9.19(DECAY)
Unconnected: U$9.27(HOME)

### Notes on the sheet
- 100VDC Ceramic cap !

## Sheet 7 of 10
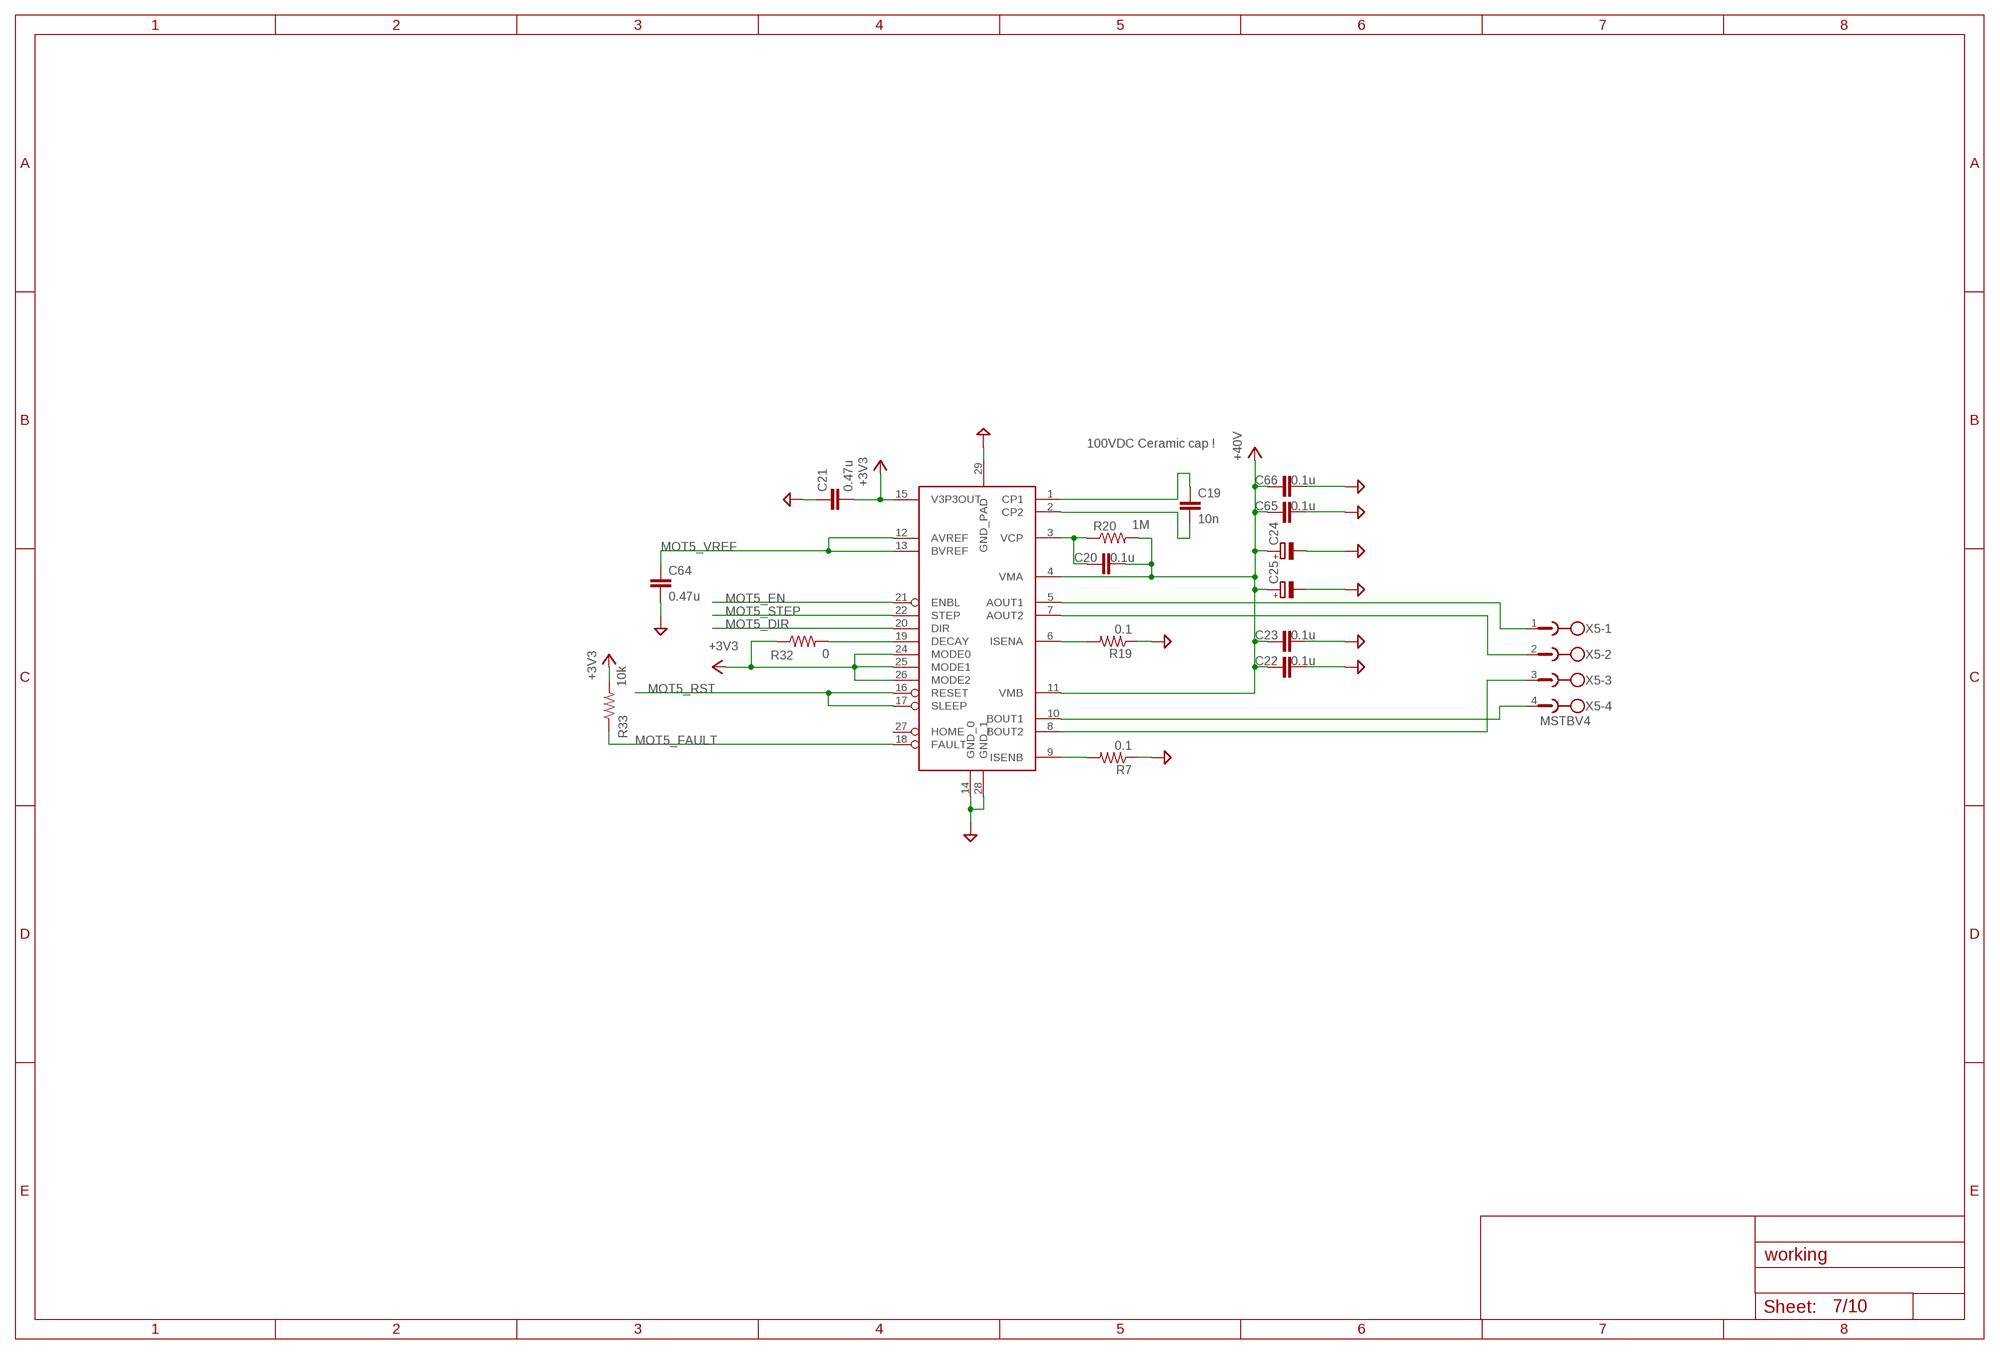
[diagram p6: schematic, sheet 7]

### Parts
C19  10n  CAP_0603  [R0603]
C20  0.1u  CAP_0603  [R0603]
C21  0.47u  CAP_0603  [R0603]
C22  0.1u  CAP_0603  [R0603]
C23  0.1u  CAP_0603  [R0603]
C24  CPOL-EUE5-5  [E5-5]
C25  CPOL-EUE5-5  [E5-5]
C64  0.47u  CAP_0603  [R0603]
C65  0.1u  CAP_0603  [R0603]
C66  0.1u  CAP_0603  [R0603]
R7  0.1  RES_1206  [R1206]
R19  0.1  RES_1206  [R1206]
R20  1M  RES_0603  [R0603]
R32  0  RES_0603  [R0603]
R33  10k  RES_0603  [R0603]
U$8  DRV8825PWP  [TSSOP-28]
X5  MSTBV4  [MSTBV4]

### Nets
+3V3: C21.2 R32.1 R33.2 U$8.15(V3P3OUT) U$8.24(MODE0) U$8.25(MODE1) U$8.26(MODE2) ; also sheet 1,2,3,4,5,6,8,9,10
+40V: C20.2 C22.1 C23.1 C24.+ C25.+ C65.1 C66.1 R20.2 U$8.4(VMA) U$8.11(VMB) ; also sheet 2,3,4,5,6
GND: C21.1 C22.2 C23.2 C24.- C25.- C64.2 C65.2 C66.2 R7.1 R19.1 U$8.14(GND_0) U$8.28(GND_1) U$8.29(GND_PAD) ; also sheet 1,2,3,4,5,6,8,9,10
MOT5_DIR: U$8.20(DIR)
MOT5_EN: U$8.21(ENBL)
MOT5_FAULT: R33.1 U$8.18(FAULT)
MOT5_RST: U$8.16(RESET) U$8.17(SLEEP)
MOT5_STEP: U$8.22(STEP)
MOT5_VREF: C64.1 U$8.12(AVREF) U$8.13(BVREF) ; also sheet 2
N$48: R19.2 U$8.6(ISENA)
N$49: R7.2 U$8.9(ISENB)
N$50: C19.1 U$8.1(CP1)
N$51: C19.2 U$8.2(CP2)
N$52: C20.1 R20.1 U$8.3(VCP)
N$53: U$8.5(AOUT1) X5.1
N$54: U$8.7(AOUT2) X5.2
N$55: U$8.8(BOUT2) X5.3
N$56: U$8.10(BOUT1) X5.4
N$57: R32.2 U$8.19(DECAY)
Unconnected: U$8.27(HOME)

### Notes on the sheet
- 100VDC Ceramic cap !

## Sheet 8 of 10
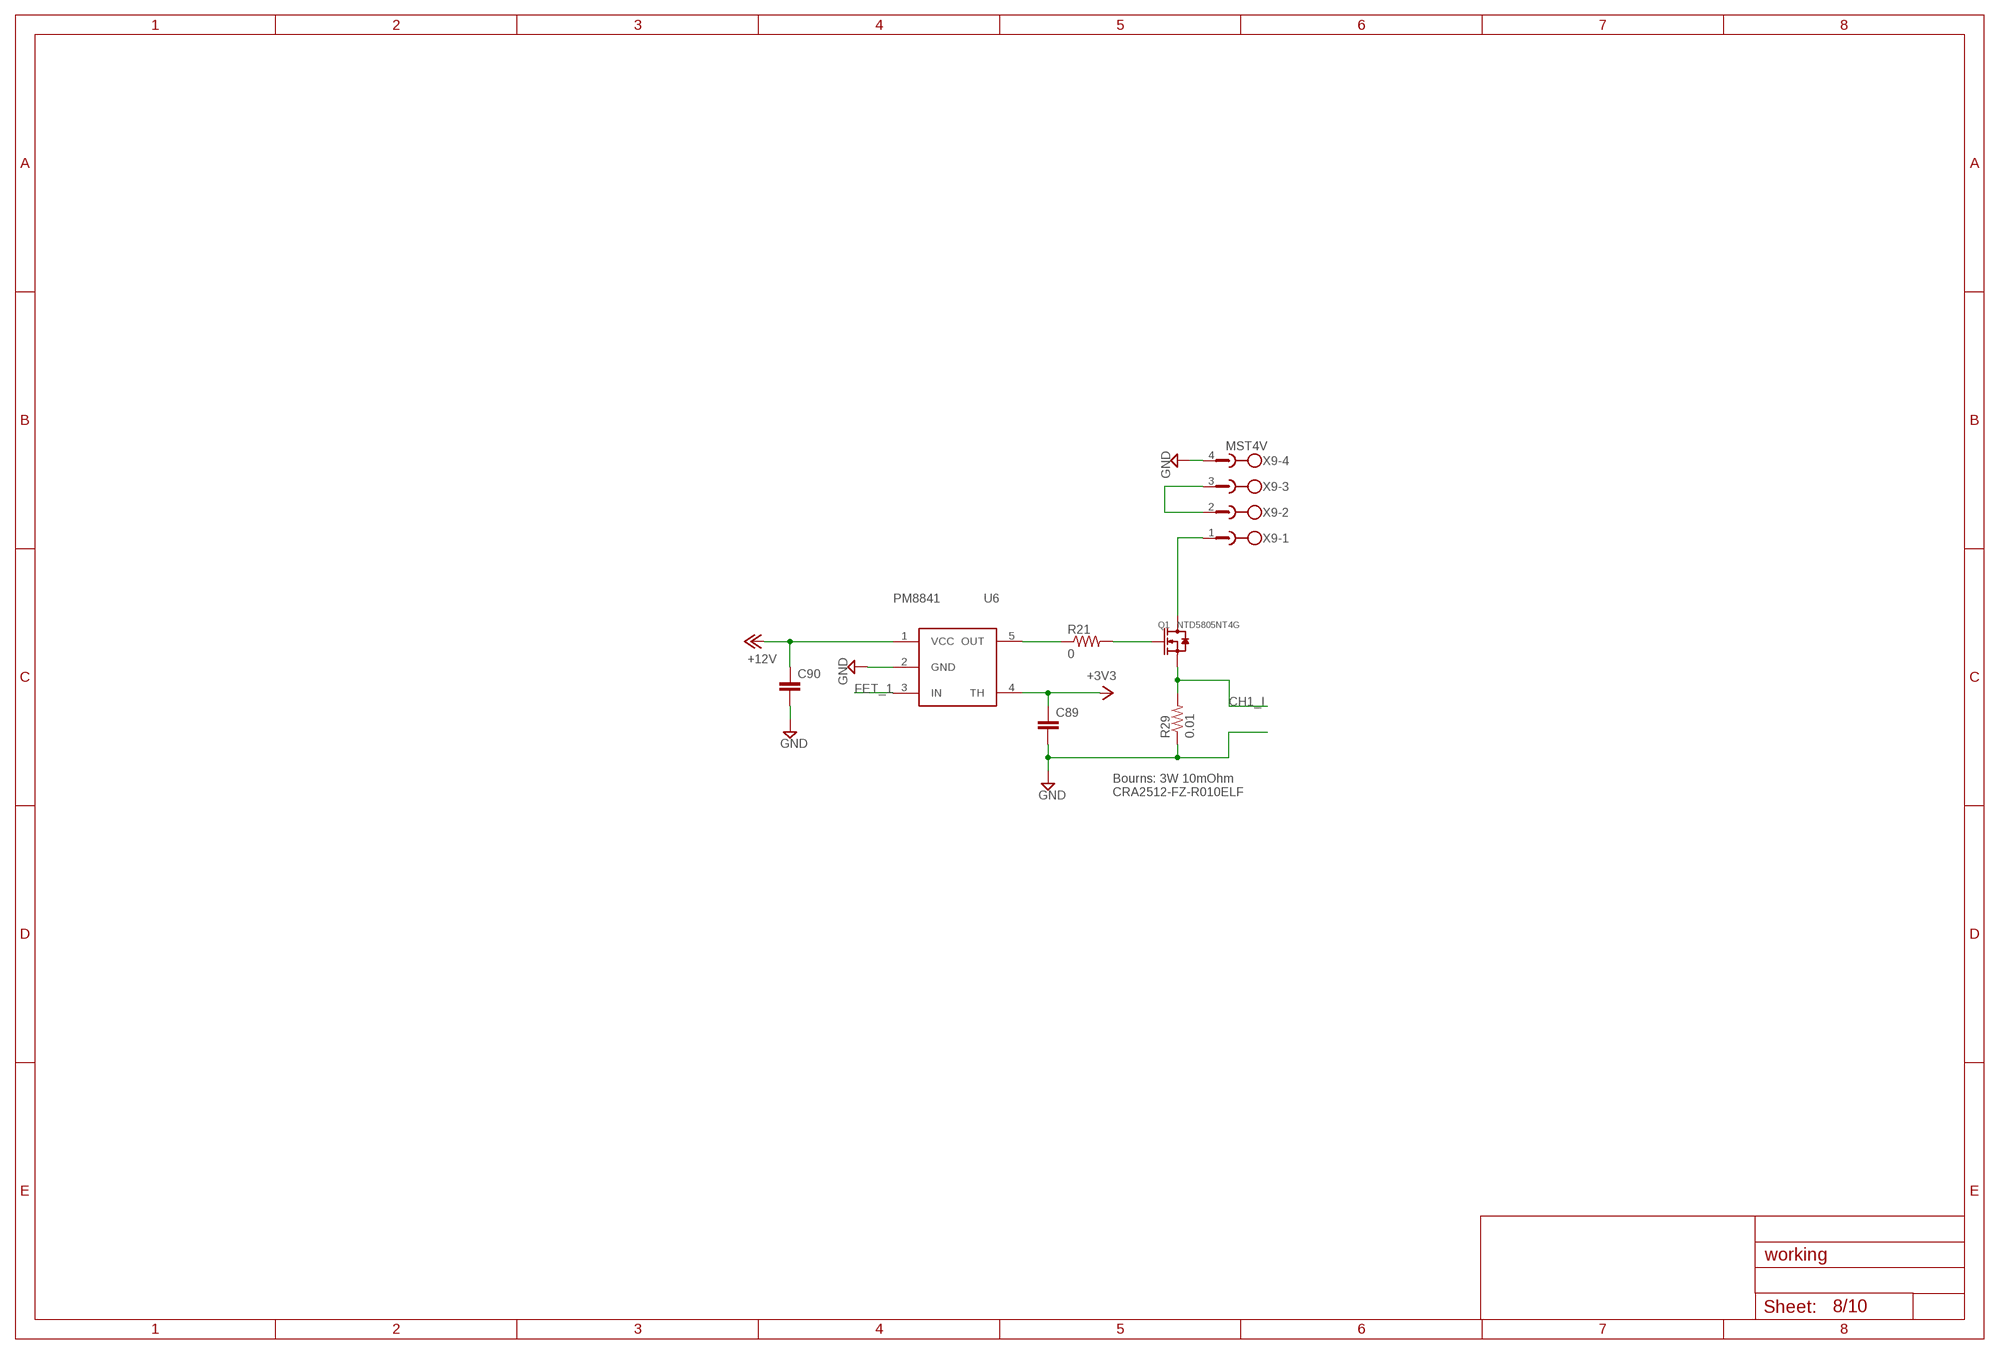
[diagram p7: schematic, sheet 8]

### Parts
C89  C-EUC0603  [C0603]
C90  C-EUC0603  [C0603]
Q1  NTD5805NT4G  INFINEON-OPTIMOS-IPD048N96L3G  [DPAK]
R21  0  RES_1206  [R1206]
R29  0.01  RES_2512  [R2512]
U6  PM8841  [SOT23-5]
X9  MST4V  [MSTBV4]

### Nets
+3V3: C89.1 U6.4(TH) ; also sheet 1,2,3,4,5,6,7,9,10
+12V: C90.1 U6.1(VCC) ; also sheet 2,9,10
CH1_I: Q1.3(S) R29.2
FET_1: U6.3(IN)
GND: C89.2 C90.2 R29.1 U6.2(GND) X9.4 ; also sheet 1,2,3,4,5,6,7,9,10
N$34: Q1.2(D) X9.1
N$35: R21.1 U6.5(OUT)
N$36: Q1.1(G) R21.2
N$59: X9.2 X9.3

### Notes on the sheet
- Bourns: 3W 10mOhm
  CRA2512-FZ-R010ELF

## Sheet 9 of 10
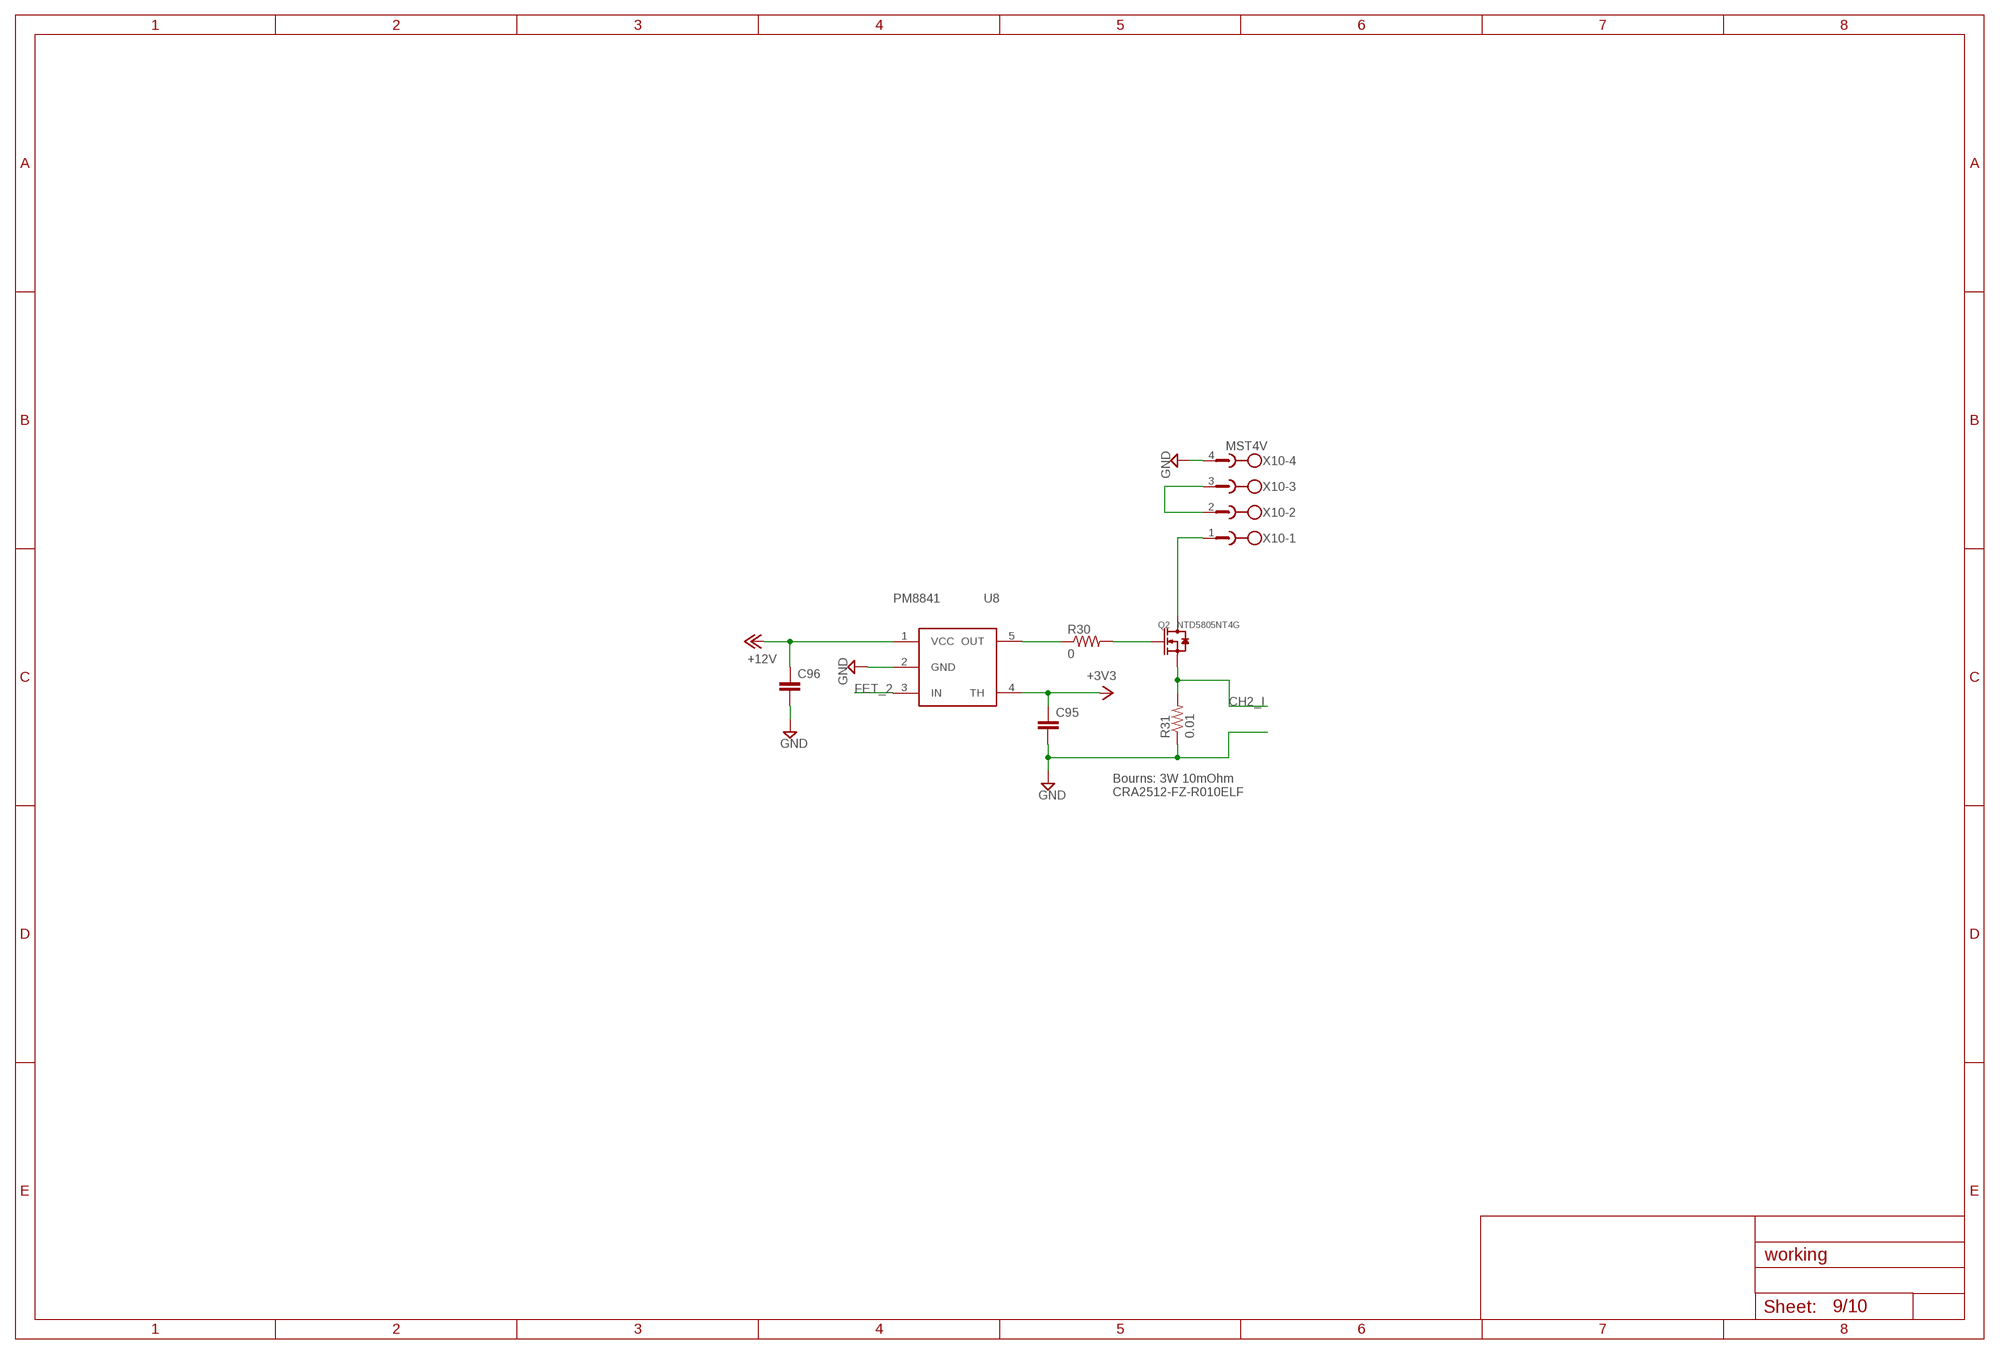
[diagram p8: schematic, sheet 9]

### Parts
C95  C-EUC0603  [C0603]
C96  C-EUC0603  [C0603]
Q2  NTD5805NT4G  INFINEON-OPTIMOS-IPD048N96L3G  [DPAK]
R30  0  RES_1206  [R1206]
R31  0.01  RES_2512  [R2512]
U8  PM8841  [SOT23-5]
X10  MST4V  [MSTBV4]

### Nets
+3V3: C95.1 U8.4(TH) ; also sheet 1,2,3,4,5,6,7,8,10
+12V: C96.1 U8.1(VCC) ; also sheet 2,8,10
CH2_I: Q2.3(S) R31.2
FET_2: U8.3(IN)
GND: C95.2 C96.2 R31.1 U8.2(GND) X10.4 ; also sheet 1,2,3,4,5,6,7,8,10
N$62: R30.1 U8.5(OUT)
N$63: Q2.1(G) R30.2
N$64: Q2.2(D) X10.1
N$65: X10.2 X10.3

### Notes on the sheet
- Bourns: 3W 10mOhm
  CRA2512-FZ-R010ELF

## Sheet 10 of 10
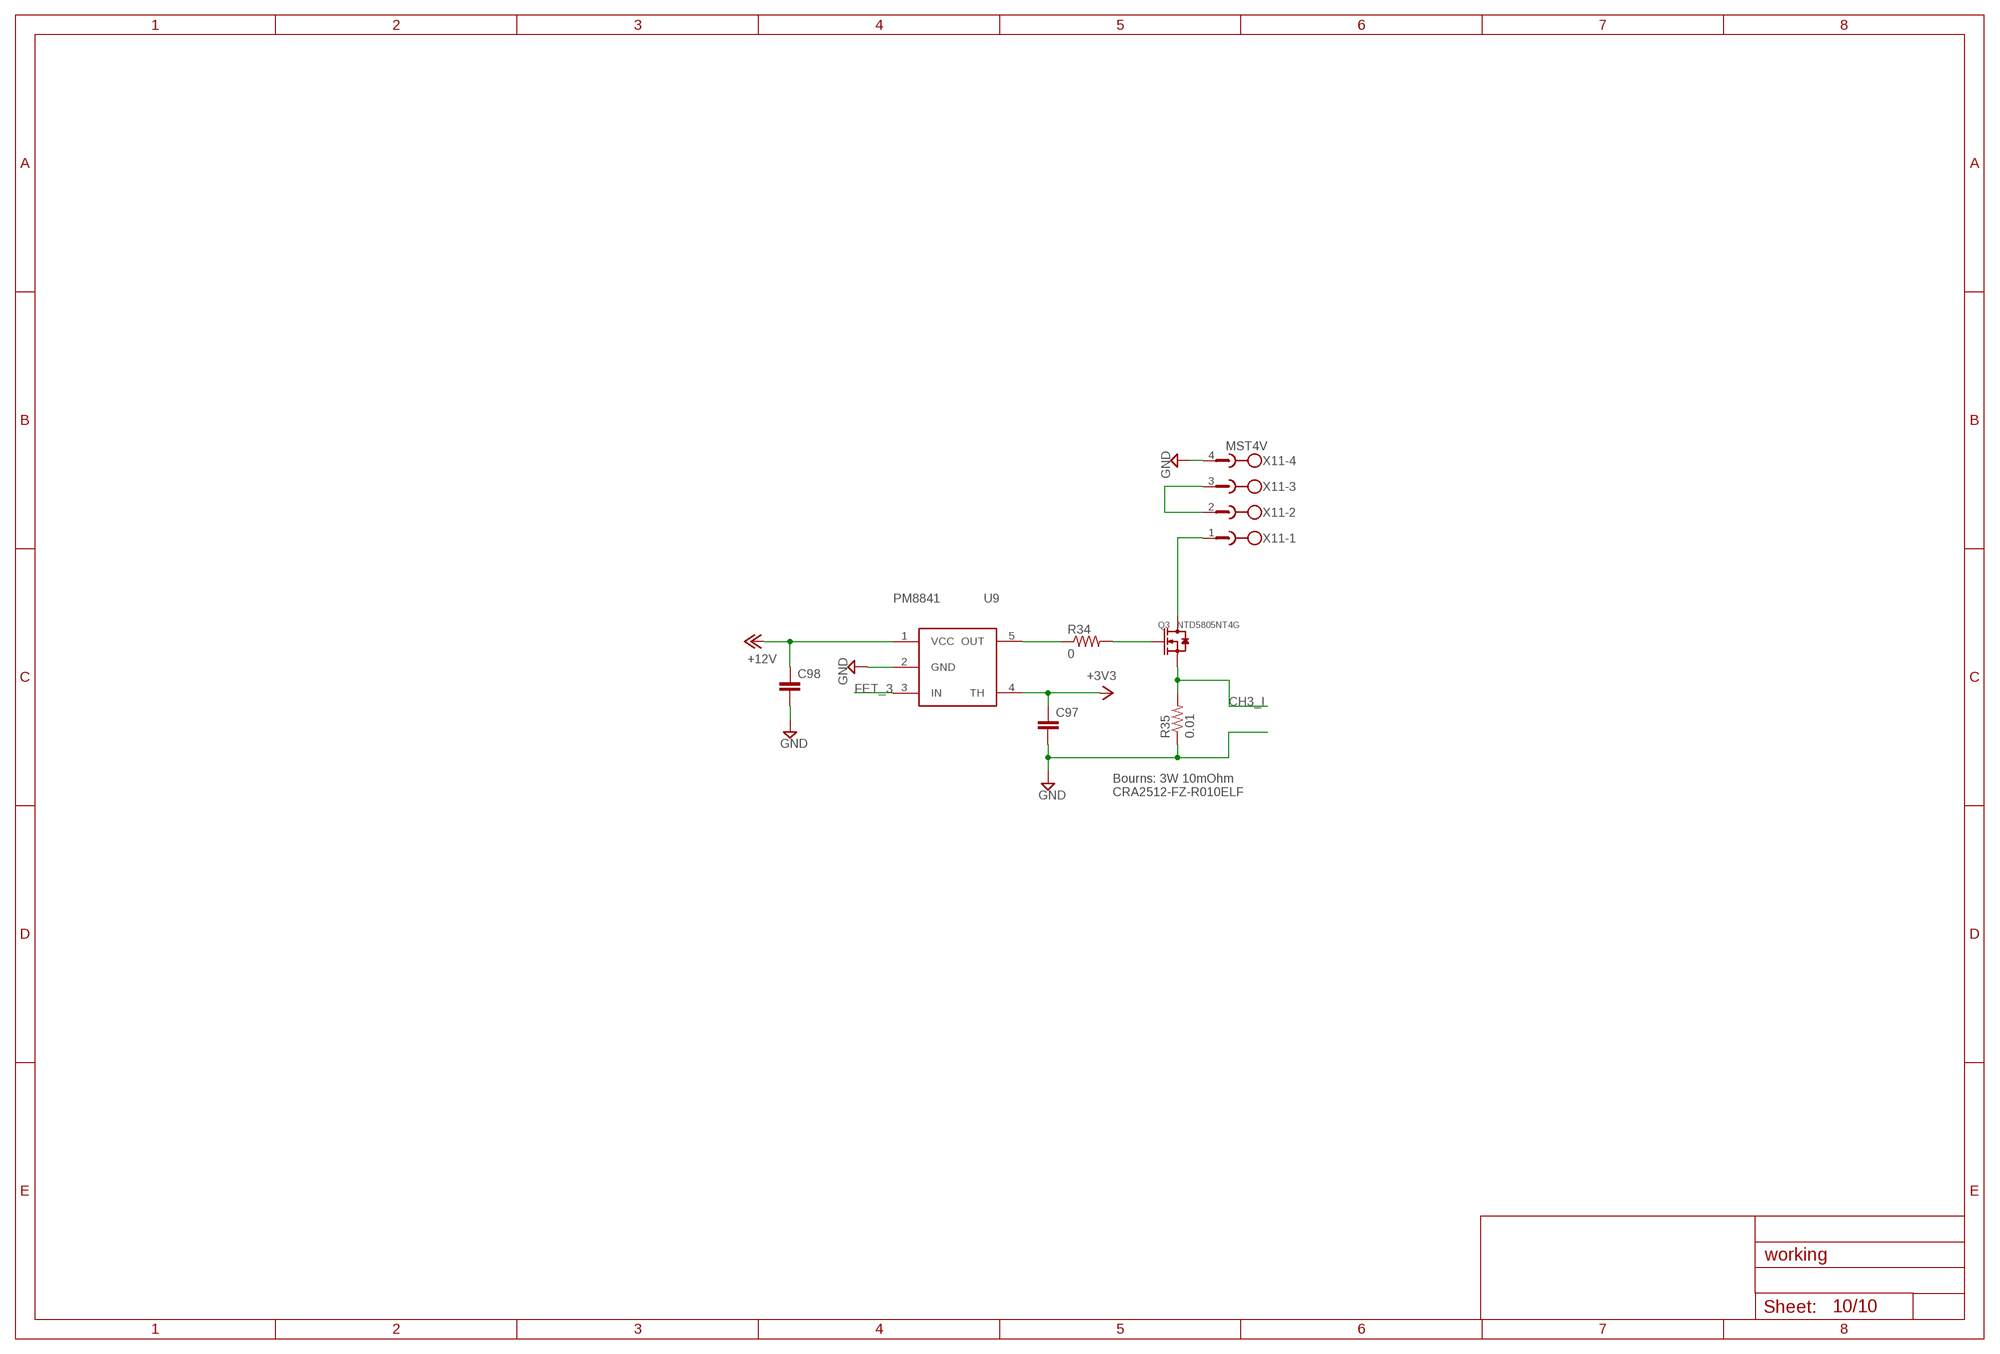
[diagram p9: schematic, sheet 10]

### Parts
C97  C-EUC0603  [C0603]
C98  C-EUC0603  [C0603]
Q3  NTD5805NT4G  INFINEON-OPTIMOS-IPD048N96L3G  [DPAK]
R34  0  RES_1206  [R1206]
R35  0.01  RES_2512  [R2512]
U9  PM8841  [SOT23-5]
X11  MST4V  [MSTBV4]

### Nets
+3V3: C97.1 U9.4(TH) ; also sheet 1,2,3,4,5,6,7,8,9
+12V: C98.1 U9.1(VCC) ; also sheet 2,8,9
CH3_I: Q3.3(S) R35.2
FET_3: U9.3(IN)
GND: C97.2 C98.2 R35.1 U9.2(GND) X11.4 ; also sheet 1,2,3,4,5,6,7,8,9
N$67: R34.1 U9.5(OUT)
N$68: Q3.1(G) R34.2
N$69: Q3.2(D) X11.1
N$70: X11.2 X11.3

### Notes on the sheet
- Bourns: 3W 10mOhm
  CRA2512-FZ-R010ELF

## Power pins joined to a net without a drawn wire
V+: U5.4(V+)
V-: U5.11(V-)

## Library data of the parts
C1-C6 C9-C13 C16-C23 C26-C28 C31-C36 C39-C53 C56-C58 C64-C66 C99-C102 = standard_passive:CAP_0603
C7 C8 C14 C15 C24 C25 C37 C38 C54 C55 C85-C88 C91-C94 = rcl:CPOL-EU: POLARIZED CAPACITOR, European symbol
C29 C30 C59-C63 C67-C84 = rcl:C-EU: CAPACITOR, European symbol
C89 C90 C95-C98 = resistor:C-EU: CAPACITOR, European symbol
D1 D2 = diode:SCHOTTKY-DIODE: Schottky Diode
JP1-JP4 = pinhead:PINHD-1X2: PIN HEADER
L1 L2 = Panasonic-ELC:ELC: Choke Coils; CURRENTRATING: 3.20A; MPN: ELC18B101L; OC_FARNELL: 1308471; OC_NEWARK: 31M4919; PACKAGE: Radial Lead-TH; SUPPLIER: PANASONIC
Q1-Q3 = infineon_optimos:INFINEON-OPTIMOS-IPD048N96L3G: 305030078; MPN: NTD5805NT4G
R1 R2 R4 R5 R7-R9 R19 R21 R24 R25 R30 R34 = standard_passive:RES_1206
R3 R6 R10-R18 R20 R22 R23 R26-R28 R32 R33 R36-R40 = standard_passive:RES_0603
R29 R31 R35 = standard_passive:RES_2512
U1 = xilinx:6SLX9TQG144: Xilinx FPGA: 6SLX9TQG144
U2 = Seeed-OPL-ic:PMIC-LM2576HVS-5.0/NOPB(TO263-5): 310030257; MPN: LM2576HVS-5.0/NOPB
U3 = dac:MAX5723/4/5
U4 U5 = opamp:TLV4379
U6 U8 U9 = pm8841:PM8841
U7 = LM257XHV:PMIC-LM2575HVS-12.0/NOPB(TO263-5): 310030257; MPN: LM2576HVS-12.0/NOPB
U10 = mcp3204:MCP3208-CI/SL: IC, 12 ADC, SMD, 3208; MPN: MCP3208-CI/SL; OC_FARNELL: 1084270; OC_NEWARK: 69K7605; PACKAGE: SOIC16; SUPPLIER: Microchip
U$1 U$3 U$4 U$8 U$9 = motor_drivers:DRV8825PWP
U$6 = oscillators:3.2X2.5X2.0-TCXO
U$21 = mcp1525:MCP1525T-I/TT: Voltage References; MPN: MCP1525T-I/TT; OC_FARNELL: 9758500; OC_NEWARK: 89C7118; PACKAGE: SOT-3; SUPPLIER: Microchip
X1-X5 X7 X8 = con-phoenix-508:MSTBV4: PHOENIX; MPN: MSTBV 2,5/4-GF-5.08; OC_FARNELL: 1792794; OC_NEWARK: 69R9847
X6 = con-molex:87832-14: Milli-Grid Header 2.00mm (.079") Pitch; OC_FARNELL: 7434698; OC_NEWARK: unknown
X9-X11 = con-phoenix-508:MST4V: PHOENIX; OC_FARNELL: unknown; OC_NEWARK: unknown

## Net classes
0 default: width 0.15 mm, drill 0.3 mm, clearance 0.15 mm
1 power: width 0.25 mm, drill 0.3 mm, clearance 0.15 mm